# Altium project Switchberry.PrjPcb (part 2 of 3)

## Sheet 07-KSZ9031_1G_BASET_XCVR.SchDoc
size C; SheetNumber: 7; SheetTotal: 13
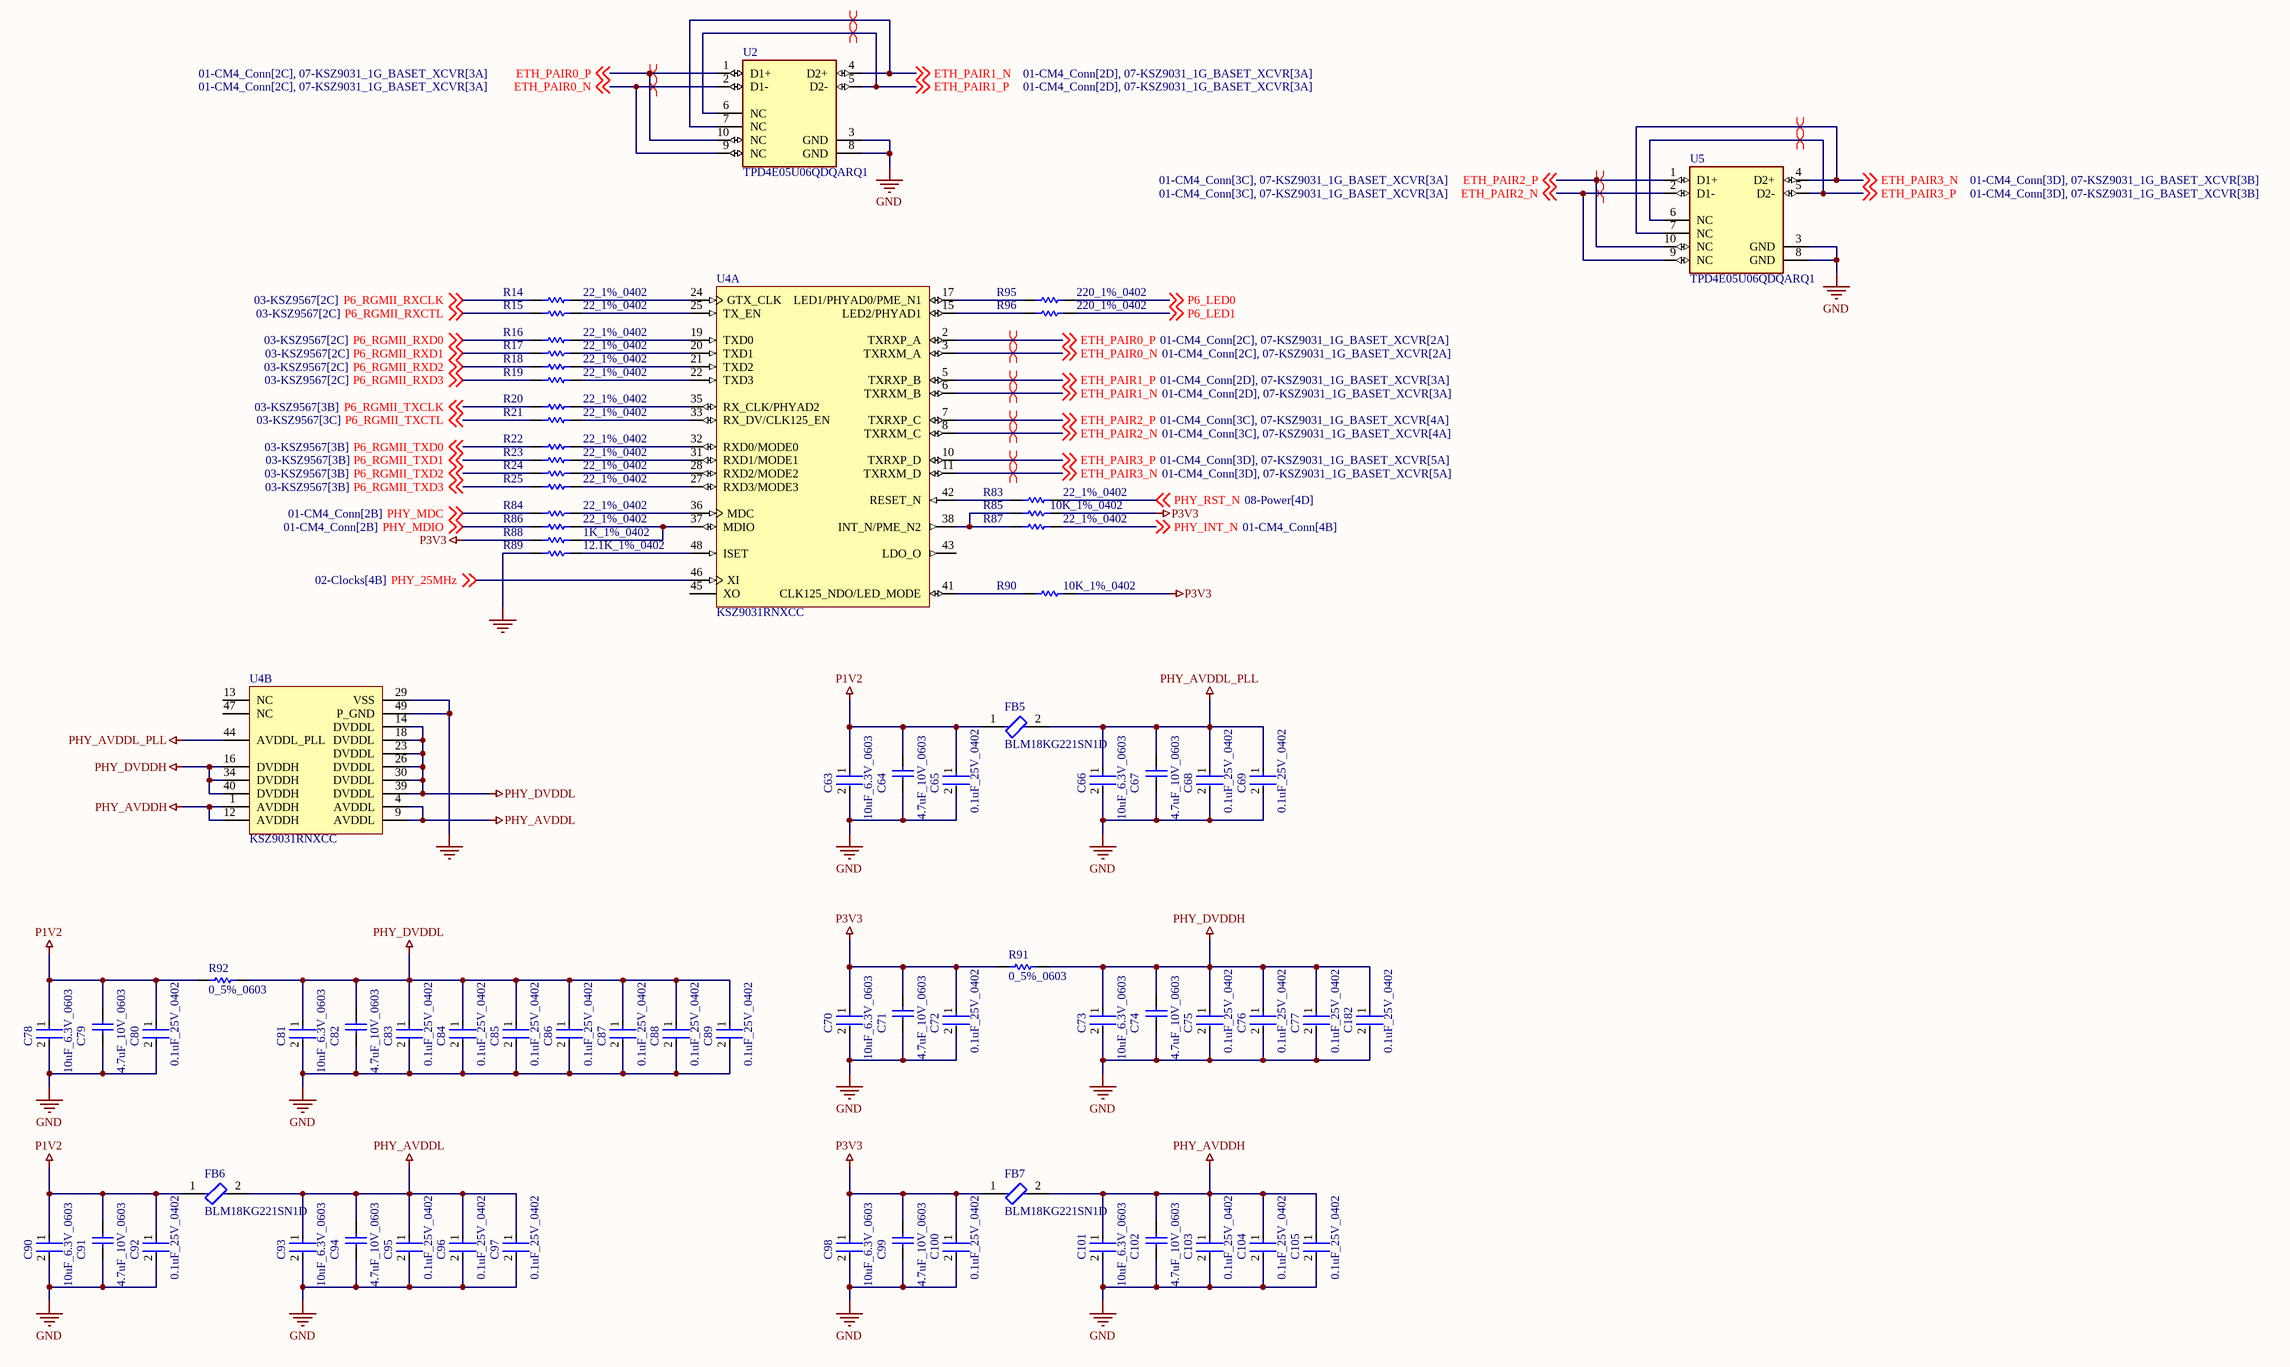
[diagram p5: 07-KSZ9031_1G_BASET_XCVR.SchDoc]

### Parts
C63  10uF_6.3V_0603  [FP-C0603C106M9PACTU-MFG]
C64  4.7uF_10V_0603  [CAPC1608X87X35NL15T15]
C65  0.1uF_25V_0402  [FP-0402-L_1_0_1-W_0_5_0_1-IPC_C]
C66  10uF_6.3V_0603  [FP-C0603C106M9PACTU-MFG]
C67  4.7uF_10V_0603  [CAPC1608X87X35NL15T15]
C68  0.1uF_25V_0402  [FP-0402-L_1_0_1-W_0_5_0_1-IPC_C]
C69  0.1uF_25V_0402  [FP-0402-L_1_0_1-W_0_5_0_1-IPC_C]
C70  10uF_6.3V_0603  [FP-C0603C106M9PACTU-MFG]
C71  4.7uF_10V_0603  [CAPC1608X87X35NL15T15]
C72  0.1uF_25V_0402  [FP-0402-L_1_0_1-W_0_5_0_1-IPC_C]
C73  10uF_6.3V_0603  [FP-C0603C106M9PACTU-MFG]
C74  4.7uF_10V_0603  [CAPC1608X87X35NL15T15]
C75  0.1uF_25V_0402  [FP-0402-L_1_0_1-W_0_5_0_1-IPC_C]
C76  0.1uF_25V_0402  [FP-0402-L_1_0_1-W_0_5_0_1-IPC_C]
C77  0.1uF_25V_0402  [FP-0402-L_1_0_1-W_0_5_0_1-IPC_C]
C78  10uF_6.3V_0603  [FP-C0603C106M9PACTU-MFG]
C79  4.7uF_10V_0603  [CAPC1608X87X35NL15T15]
C80  0.1uF_25V_0402  [FP-0402-L_1_0_1-W_0_5_0_1-IPC_C]
C81  10uF_6.3V_0603  [FP-C0603C106M9PACTU-MFG]
C82  4.7uF_10V_0603  [CAPC1608X87X35NL15T15]
C83  0.1uF_25V_0402  [FP-0402-L_1_0_1-W_0_5_0_1-IPC_C]
C84  0.1uF_25V_0402  [FP-0402-L_1_0_1-W_0_5_0_1-IPC_C]
C85  0.1uF_25V_0402  [FP-0402-L_1_0_1-W_0_5_0_1-IPC_C]
C86  0.1uF_25V_0402  [FP-0402-L_1_0_1-W_0_5_0_1-IPC_C]
C87  0.1uF_25V_0402  [FP-0402-L_1_0_1-W_0_5_0_1-IPC_C]
C88  0.1uF_25V_0402  [FP-0402-L_1_0_1-W_0_5_0_1-IPC_C]
C89  0.1uF_25V_0402  [FP-0402-L_1_0_1-W_0_5_0_1-IPC_C]
C90  10uF_6.3V_0603  [FP-C0603C106M9PACTU-MFG]
C91  4.7uF_10V_0603  [CAPC1608X87X35NL15T15]
C92  0.1uF_25V_0402  [FP-0402-L_1_0_1-W_0_5_0_1-IPC_C]
C93  10uF_6.3V_0603  [FP-C0603C106M9PACTU-MFG]
C94  4.7uF_10V_0603  [CAPC1608X87X35NL15T15]
C95  0.1uF_25V_0402  [FP-0402-L_1_0_1-W_0_5_0_1-IPC_C]
C96  0.1uF_25V_0402  [FP-0402-L_1_0_1-W_0_5_0_1-IPC_C]
C97  0.1uF_25V_0402  [FP-0402-L_1_0_1-W_0_5_0_1-IPC_C]
C98  10uF_6.3V_0603  [FP-C0603C106M9PACTU-MFG]
C99  4.7uF_10V_0603  [CAPC1608X87X35NL15T15]
C100  0.1uF_25V_0402  [FP-0402-L_1_0_1-W_0_5_0_1-IPC_C]
C101  10uF_6.3V_0603  [FP-C0603C106M9PACTU-MFG]
C102  4.7uF_10V_0603  [CAPC1608X87X35NL15T15]
C103  0.1uF_25V_0402  [FP-0402-L_1_0_1-W_0_5_0_1-IPC_C]
C104  0.1uF_25V_0402  [FP-0402-L_1_0_1-W_0_5_0_1-IPC_C]
C105  0.1uF_25V_0402  [FP-0402-L_1_0_1-W_0_5_0_1-IPC_C]
C182  0.1uF_25V_0402  [FP-0402-L_1_0_1-W_0_5_0_1-IPC_C]
FB5  BLM18KG221SN1D  [FP-BLM18-0_15-t0_8-IPC_B]
FB6  BLM18KG221SN1D  [FP-BLM18-0_15-t0_8-IPC_B]
FB7  BLM18KG221SN1D  [FP-BLM18-0_15-t0_8-IPC_B]
R14  22_1%_0402  [RESC1005X40X25ML05T10]
R15  22_1%_0402  [RESC1005X40X25ML05T10]
R16  22_1%_0402  [RESC1005X40X25ML05T10]
R17  22_1%_0402  [RESC1005X40X25ML05T10]
R18  22_1%_0402  [RESC1005X40X25ML05T10]
R19  22_1%_0402  [RESC1005X40X25ML05T10]
R20  22_1%_0402  [RESC1005X40X25ML05T10]
R21  22_1%_0402  [RESC1005X40X25ML05T10]
R22  22_1%_0402  [RESC1005X40X25ML05T10]
R23  22_1%_0402  [RESC1005X40X25ML05T10]
R24  22_1%_0402  [RESC1005X40X25ML05T10]
R25  22_1%_0402  [RESC1005X40X25ML05T10]
R83  22_1%_0402  [RESC1005X40X25ML05T10]
R84  22_1%_0402  [RESC1005X40X25ML05T10]
R85  10K_1%_0402  [RESC1005X40X25NL10T10]
R86  22_1%_0402  [RESC1005X40X25ML05T10]
R87  22_1%_0402  [RESC1005X40X25ML05T10]
R88  1K_1%_0402  [RESC1005X40X25ML05T10]
R89  12.1K_1%_0402  [RESC1005X40X25NL10T10]
R90  10K_1%_0402  [RESC1005X40X25NL10T10]
R91  0_5%_0603  [RESC1608X55X25ML10T15]
R92  0_5%_0603  [RESC1608X55X25ML10T15]
R95  220_1%_0402  [RESC1005X40X25NL05T10]
R96  220_1%_0402  [RESC1005X40X25NL05T10]
U2  TPD4E05U06QDQARQ1  [FP-DQA0010A-MFG]
U4  KSZ9031RNXCC  [MICL-QFN-48_V]  (parts A,B of 2)
U5  TPD4E05U06QDQARQ1  [FP-DQA0010A-MFG]

### Nets
GND: C63.2 C64.1 C65.2 C66.2 C67.1 C68.2 C69.2 C70.2 C71.1 C72.2 C73.2 C74.1 C75.2 C76.2 C77.2 C78.2 C79.1 C80.2 C81.2 C82.1 C83.2 C84.2 C85.2 C86.2 C87.2 C88.2 C89.2 C90.2 C91.1 C92.2 C93.2 C94.1 C95.2 C96.2 C97.2 C98.2 C99.1 C100.2 C101.2 C102.1 C103.2 C104.2 C105.2 C182.2 R89.1 U2.3(GND) U2.8(GND) U4.29(VSS) U4.49(P_GND) U5.3(GND) U5.8(GND)
P1V2: C63.1 C64.2 C65.1 C78.1 C79.2 C80.1 C90.1 C91.2 C92.1 FB5.1 FB6.1 R92.1
P3V3: C70.1 C71.2 C72.1 C98.1 C99.2 C100.1 FB7.1 R85.2 R88.1 R90.2 R91.1
PHY_AVDDH: C101.1 C102.2 C103.1 C104.1 C105.1 FB7.2 U4.1(AVDDH) U4.12(AVDDH)
PHY_AVDDL: C93.1 C94.2 C95.1 C96.1 C97.1 FB6.2 U4.4(AVDDL) U4.9(AVDDL)
PHY_AVDDL_PLL: C66.1 C67.2 C68.1 C69.1 FB5.2 U4.44(AVDDL_PLL)
PHY_DVDDH: C73.1 C74.2 C75.1 C76.1 C77.1 C182.1 R91.2 U4.16(DVDDH) U4.34(DVDDH) U4.40(DVDDH)
PHY_DVDDL: C81.1 C82.2 C83.1 C84.1 C85.1 C86.1 C87.1 C88.1 C89.1 R92.2 U4.14(DVDDL) U4.18(DVDDL) U4.23(DVDDL) U4.26(DVDDL) U4.30(DVDDL) U4.39(DVDDL)
ETH_PAIR0_N: U2.2(D1-) U2.9(NC) U4.3(TXRXM_A) ; off-sheet ETH_PAIR0_N
ETH_PAIR0_P: U2.1(D1+) U2.10(NC) U4.2(TXRXP_A) ; off-sheet ETH_PAIR0_P
ETH_PAIR1_N: U2.4(D2+) U2.7(NC) U4.6(TXRXM_B) ; off-sheet ETH_PAIR1_N
ETH_PAIR1_P: U2.5(D2-) U2.6(NC) U4.5(TXRXP_B) ; off-sheet ETH_PAIR1_P
ETH_PAIR2_N: U4.8(TXRXM_C) U5.2(D1-) U5.9(NC) ; off-sheet ETH_PAIR2_N
ETH_PAIR2_P: U4.7(TXRXP_C) U5.1(D1+) U5.10(NC) ; off-sheet ETH_PAIR2_P
ETH_PAIR3_N: U4.11(TXRXM_D) U5.4(D2+) U5.7(NC) ; off-sheet ETH_PAIR3_N
ETH_PAIR3_P: U4.10(TXRXP_D) U5.5(D2-) U5.6(NC) ; off-sheet ETH_PAIR3_P
P6_LED0: R95.2 ; off-sheet P6_LED0
P6_LED1: R96.2 ; off-sheet P6_LED1
P6_RGMII_RXCLK: R14.1 ; off-sheet P6_RGMII_RXCLK
P6_RGMII_RXCTL: R15.1 ; off-sheet P6_RGMII_RXCTL
P6_RGMII_RXD0: R16.1 ; off-sheet P6_RGMII_RXD0
P6_RGMII_RXD1: R17.1 ; off-sheet P6_RGMII_RXD1
P6_RGMII_RXD2: R18.1 ; off-sheet P6_RGMII_RXD2
P6_RGMII_RXD3: R19.1 ; off-sheet P6_RGMII_RXD3
P6_RGMII_TXCLK: R20.1 ; off-sheet P6_RGMII_TXCLK
P6_RGMII_TXCTL: R21.1 ; off-sheet P6_RGMII_TXCTL
P6_RGMII_TXD0: R22.1 ; off-sheet P6_RGMII_TXD0
P6_RGMII_TXD1: R23.1 ; off-sheet P6_RGMII_TXD1
P6_RGMII_TXD2: R24.1 ; off-sheet P6_RGMII_TXD2
P6_RGMII_TXD3: R25.1 ; off-sheet P6_RGMII_TXD3
PHY_25MHz: U4.46(XI) ; off-sheet PHY_25MHz
PHY_INT_N: R87.2 ; off-sheet PHY_INT_N
PHY_MDC: R84.1 ; off-sheet PHY_MDC
PHY_MDIO: R86.1 ; off-sheet PHY_MDIO
PHY_RST_N: R83.2 ; off-sheet PHY_RST_N
NetR14_2: R14.2 U4.24(GTX_CLK)
NetR15_2: R15.2 U4.25(TX_EN)
NetR16_2: R16.2 U4.19(TXD0)
NetR17_2: R17.2 U4.20(TXD1)
NetR18_2: R18.2 U4.21(TXD2)
NetR19_2: R19.2 U4.22(TXD3)
NetR20_2: R20.2 U4.35(RX_CLK/PHYAD2)
NetR21_2: R21.2 U4.33(RX_DV/CLK125_EN)
NetR22_2: R22.2 U4.32(RXD0/MODE0)
NetR23_2: R23.2 U4.31(RXD1/MODE1)
NetR24_2: R24.2 U4.28(RXD2/MODE2)
NetR25_2: R25.2 U4.27(RXD3/MODE3)
NetR83_1: R83.1 U4.42(RESET_N)
NetR84_2: R84.2 U4.36(MDC)
NetR85_1: R85.1 R87.1 U4.38(INT_N/PME_N2)
NetR86_2: R86.2 R88.2 U4.37(MDIO)
NetR89_2: R89.2 U4.48(ISET)
NetR90_1: R90.1 U4.41(CLK125_NDO/LED_MODE)
NetR95_1: R95.1 U4.17(LED1/PHYAD0/PME_N1)
NetR96_1: R96.1 U4.15(LED2/PHYAD1)

Not connected (* = marked no-connect by the designer): U4 13(NC) 43(LDO_O) 45(XO) 47(NC)

### Layout directives
differential pair: ETH_PAIR0_N, ETH_PAIR0_P, ETH_PAIR1_N, ETH_PAIR1_P, ETH_PAIR2_N, ETH_PAIR2_P, ETH_PAIR3_N, ETH_PAIR3_P

### Library data of the parts
C63 C66 C70 C73 C78 C81 C90 C93 C98 C101 = CMP-2006-02285-3: CAP CER 10UF 6.3V X5R 0603; Manufacturer Part Number: C0603C106M9PACTU; Manufacturer: Kemet; Material: Ceramic; Temperature Coefficient: 15%; Tolerance: 20%; Category: Cap; Height: 0.9mm; Digikey Description: CAP CER 10UF 6.3V X5R 0603; Mouser Description: In a Pack of 10, KEMET 0603 (1608M) 10µF MLCC 6.3V dc ±20% SMD C0603C106M9PACTU; Voltage Rating: 6.3V; Device Class L2: Capacitors; Temperature Range Low: -55°C; Temperature Characteristic: X5R; ComponentLink2Description: Datasheet; Ipc Land Pattern Name: CAPC16080X80; ComponentLink2URL: http://www.kemet.com/Lists/ProductCatalog/Attachments/19/KEM_C1006_X5R_SMD.pdf; Capacitance: 10uF; Temperature Range High: +85°C; Device Class L3: Ceramic Capacitors; RoHS: TRUE; Automotive: No; Value: 10uF; Temperature: -55°C to +85°C; Device Class L1: Passive Components; Package: C0603C106M9PACTU; Lead Free: Yes; Octopart: https://octopart.com/c0603c106m9pactu-kemet-8375727
C64 C67 C71 C74 C79 C82 C91 C94 C99 C102 = CMP-2006-03238-1: Part Number: C0603C475K8PACTU; Manufacturer: Kemet
C65 C68 C69 C72 C75-C77 C80 C83-C89 C92 C95-C97 C100 C103-C105 C182 = CMP-2008-02519-2: as C3 on sheet 05-Switch_SFP_CM4_RJ45; Package Quantity: 1; Capacitance: 100nF; Min Operating Temperature: -55°C; Voltage: 25V; Voltage Rating: 25V; Construction: Flat; Max Operating Temperature: 125°C; Radiation Hardening: No; Depth: 0.5mm; Thickness: 0.022inch; Voltage Rating (DC): 25V; Number of Pins: 2; Lead Free: Lead Free; Series: -; REACH SVHC: No SVHC; Length: 1mm; Dielectric: X7R; RoHS Compliant: Yes; Mount: Surface Mount; Packaging: Tape and Reel; Case/Package: 0402; Case Code (Imperial): 0402; Termination: SMD/SMT; Width: 0.02inch; Case Code (Metric): 1005; Tolerance: 10%
FB5-FB7 = CMP-0686-00556-7: Chip Ferrite Bead, 0603, 220Ω @ 100MHz, 0.05Ω, 25%, 2.2A; DC Resistance (DCR): 50mR; Number of Circuits: 1; Impedance: 220R; Current Rating: 2.2A; Material: Ferrite; Test Frequency: 100MHz; Depth: 0.8mm; Series: BLM18K; RoHS Compliant: Yes; Termination: SMD/SMT; Max Current Rating: 2.2A; Case Code (Metric): 1608; Radiation Hardening: No; Number of Pins: 2; Length: 1.6mm; Lead Free: Lead Free; Package Quantity: 1; Height: 0.8mm; Core Material: Ferrite; Inductor Type: FERRITE BEAD; Min Operating Temperature: -55°C; Case/Package: 0603; Case Code (Imperial): 0603; Number of Lines: 1; Packaging: Tape and Reel; REACH SVHC: No SVHC; Max Operating Temperature: 125°C; Military Standard: Not; DC Resistance-Max: 50mR; Width: 0.8mm; DC Current: 2.2A; Max DC Current: 2.2A; Tolerance: 25%; Weight: 7.1E-05oz
R14-R25 R83 R84 R86 R87 = CMP-2002-07182-1: Part Number: RC0402FR-1322RL; Manufacturer: Yageo / Phycomp
R85 R90 = CMP-2002-04694-1: as R52 on sheet 01-CM4_Conn
R88 = CMP-2002-06478-1: Manufacturer: Multicomp; Part Number: MCMR04X1001FTL
R89 = CMP-2002-05926-1: Manufacturer: Multicomp; Part Number: MC00625W0402112K1
R91 R92 = CMP-2100-03667-1: Chip Resistor, 0 Ohm, +/- 5%, 0.1 W, -55 to 155 degC, 0603 (1608 Metric), RoHS, Tape and Reel; Manufacturer: Yageo; Temperature Coefficient: 200ppm/degreesC; Voltage Rating: 50V; Power Rating: 100mW; Resistance: 0mOhm; Width: 0.8mm; Max Operating Temperature: 155degC; Tolerance: 5%; Package Reference: 0603; Height: 0.45mm; Depth: 0.8mm; Package Description: 2-Pin Surface Mount Device, Body 1.6 x 0.8 mm; Termination: SMD/SMT; Package Quantity: 5000; Case/Package: 0603; Case Code (Imperial): 0603; Radiation Hardening: No; Number of Pins: 2; Length: 1.6mm; Lead Free: LeadFree; Voltage Rating (DC): 50V; Military Standard: Not; Datasheet URL: http://www.yageo.com/NewPortal/yageodocoutput?fileName=/pdf/R-Chip/PYu-RC_Group_51_RoHS_L_5.pdf; Manufacturer URL: http://www.yageo.com/; Packaging: TapeandReel; Case Code (Metric): 1608; Min Operating Temperature: -55degC; Composition: ThickFilm; RoHSCompliant: true; Contact Plating: Tin; Datasheet Version: Rev. 5, 10/2016; REACH SVHC: NoSVHC
R95 R96 = CMP-2002-07959-1: Manufacturer: Yageo / Phycomp; Part Number: RC0402JR-07220RL
U2 U5 = CMP-04985-000004-1: TVS DIODE 5.5V 14V 10USON; Manufacturer: Texas Instruments; Direction: Unidirectional; Standoff Height: 0mm; Capacitance: 0.5pF; Number Of Channels: 4; Breakdown Voltage: 6.4V; Peak Pulse Power: 2.5W; Automotive Grade: Grade 1; Value: 0.5pF; Interface: USB,Ethernet,LVDS,Other; Peak Pulse Current: 2.5A; Operating Supply Voltage: 5.5V; Reverse Standoff Voltage: 5.5V; Package: DQA0010A; Temperature Range Low: -40°C; Temperature Range High: +125°C; Ambient Temperature Range Low: -40°C; Device Class L1: Circuit Protection; Clamping Voltage: 14V; Manufacturer Part Number: TPD4E05U06QDQARQ1; Device Class L2: ESD and Circuit Protection ICs; Octopart: https://octopart.com/tpd4e05u06qdqarq1-texas+instruments-48523459; Device Class L3: unset; Height: 0.55mm; Automotive: Yes; ComponentLink2Description: Datasheet; RoHS: TRUE; Ambient Temperature Range High: +125°C; Category: IC; Mouser Description: Automotive 4-Channel ESD Protection Solution for SuperSpeed (up to 5 Gbps) Interface 10-USON -40 to 125; Temperature: -40°C to +125°C; ComponentLink2URL: http://www.ti.com/lit/ds/symlink/tpd4e05u06-q1.pdf; Digikey Description: TVS DIODE 5.5V 14V 10USON; Lead Free: Yes
U4 = CMP-1337-00003-2: Gigabit Ethernet Transceiver with RGMII Support, 1.14 to 1.26 V, 0 to 70 degC, 48-Pin QFN, RoHS; Manufacturer: Micrel; Output Tri-State Leakage: 10 uA Max.; ILED: 8 mA Typ.; Receivers: 4; VSET@R(ISET): 12.1 KOhm=1.2 V Typ.; DatasheetVersion: Rev. 2.1; PackageDescription: 48-Pin Quad Flat Non-Lead Package, Body 7 x 7 mm, Pitch 0.5 mm; RoHS: TRUE; DVDDL: 1.14 to 1.26 V; ComponentLink1URL: http://www.micrel.com/; PartNumber: KSZ9031RNXCC; Temperature Range: 0 to 70 degC; ComponentLink1Description: Manufacturer URL; ComponentLink3Description: Package Specification; Mounting Technology: Surface Mount; ComponentLink2Description: Datasheet; Drivers: 4; ComponentLink2URL: http://www.micrel.com/_PDF/Ethernet/datasheets/KSZ9031RNX.pdf; ComponentLink3URL: http://www.micrel.com/_PDF/Ethernet/datasheets/KSZ9031RNX.pdf

## Sheet 08-Power.SchDoc
size B; SheetNumber: 8; SheetTotal: 11
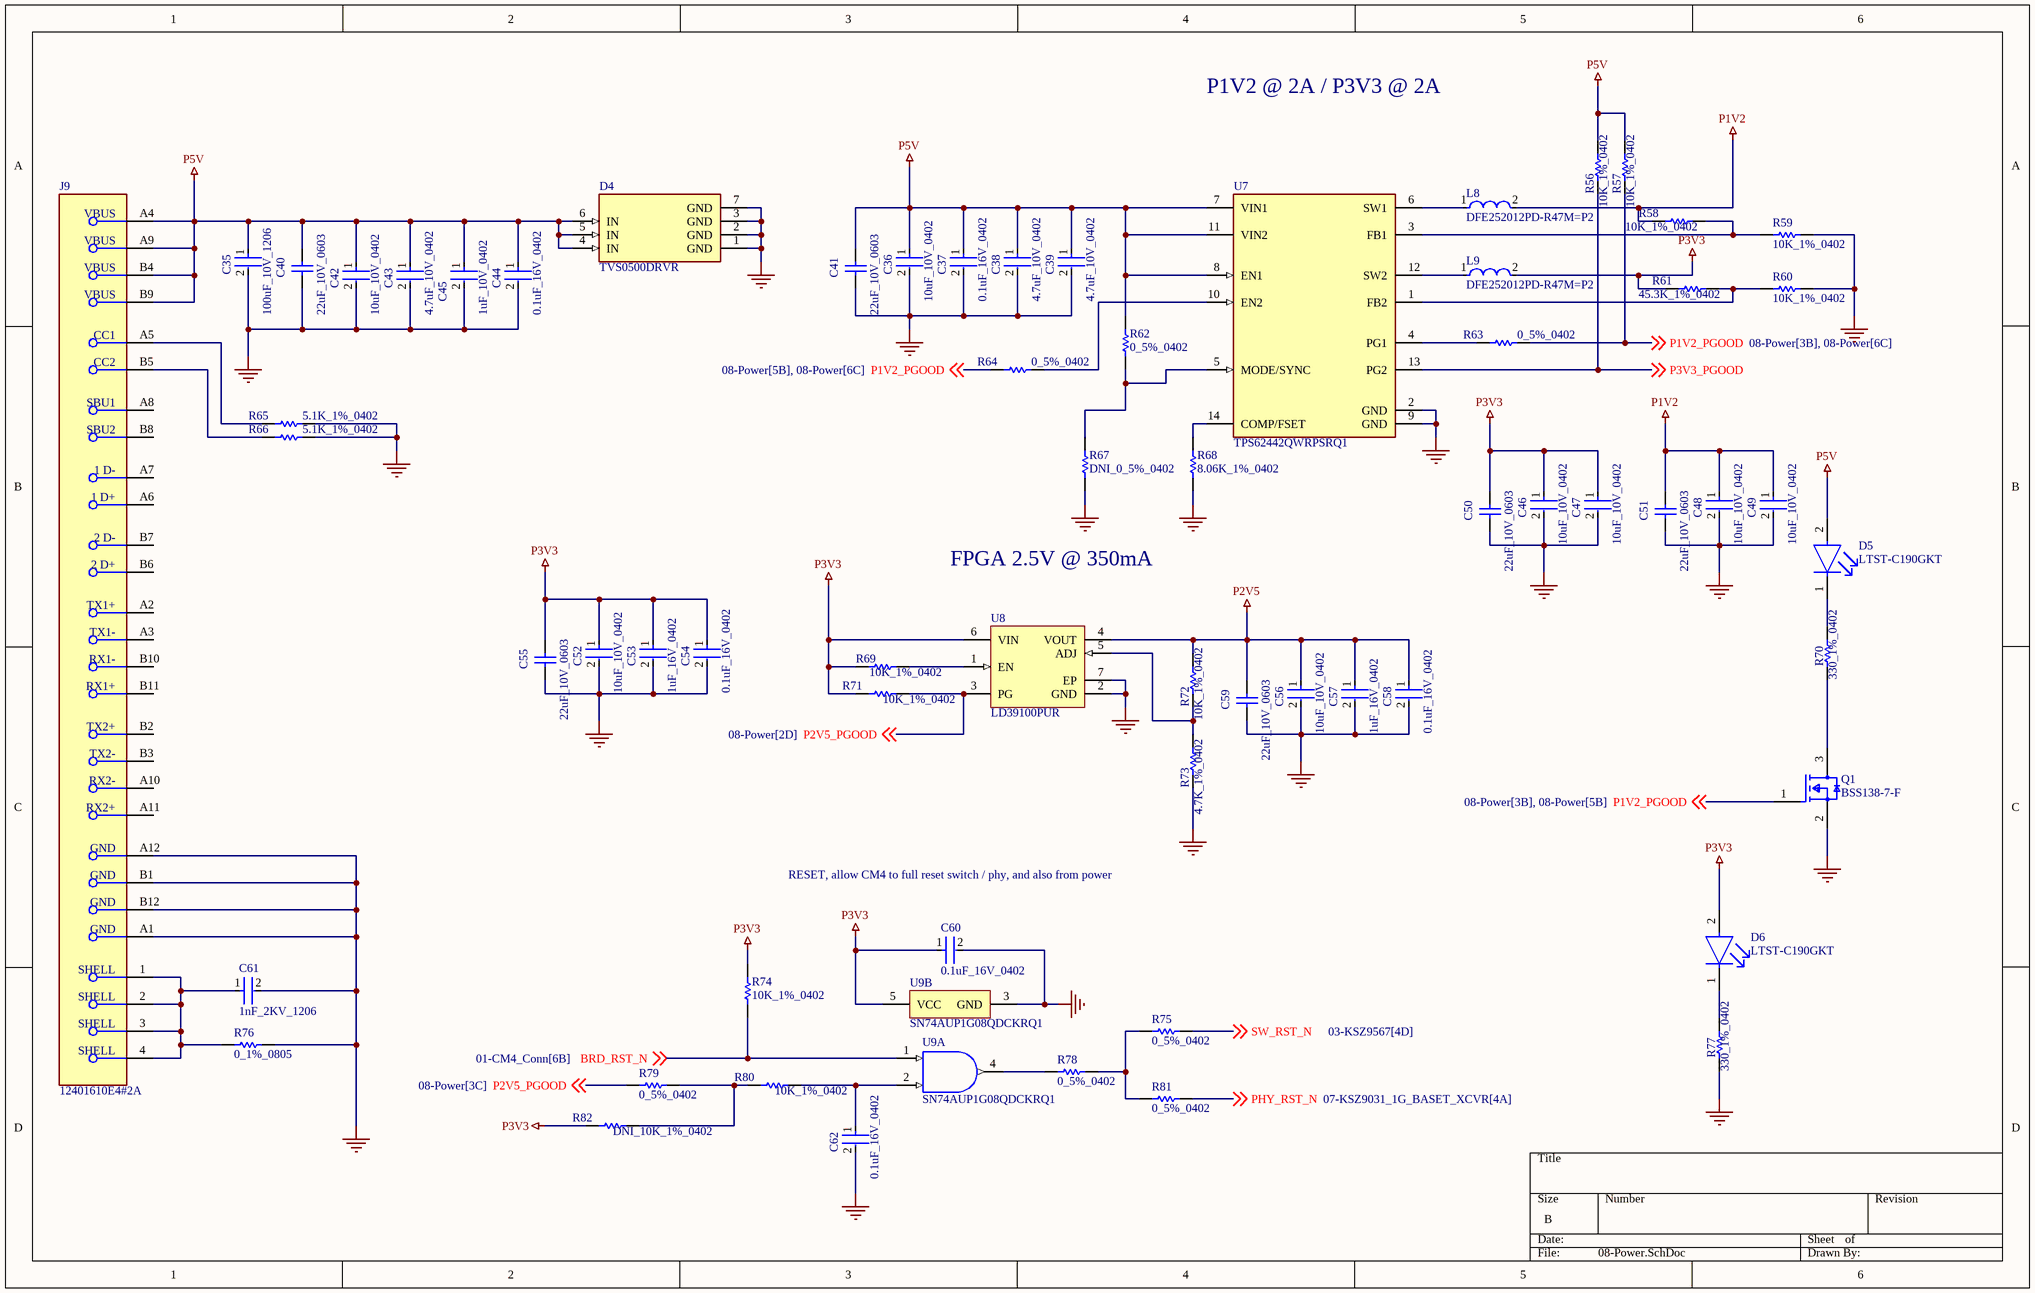
[diagram p6: 08-Power.SchDoc]

### Parts
C35  100uF_10V_1206  [FP-C3216-160-0_3-IPC_C]
C36  10uF_10V_0402  [FP-CL05A106MP5NUNC-MFG]
C37  0.1uF_16V_0402  [FP-C0402-BB-MFG]
C38  4.7uF_10V_0402  [FP-C1005-050-0_15-MFG]
C39  4.7uF_10V_0402  [FP-C1005-050-0_15-MFG]
C40  22uF_10V_0603  [CAPC1608X100X20ML10]
C41  22uF_10V_0603  [CAPC1608X100X20ML10]
C42  10uF_10V_0402  [FP-CL05A106MP5NUNC-MFG]
C43  4.7uF_10V_0402  [FP-C1005-050-0_15-MFG]
C44  0.1uF_16V_0402  [FP-C0402-BB-MFG]
C45  1uF_10V_0402  [FP-CL511-IPC_C]
C46  10uF_10V_0402  [FP-CL05A106MP5NUNC-MFG]
C47  10uF_10V_0402  [FP-CL05A106MP5NUNC-MFG]
C48  10uF_10V_0402  [FP-CL05A106MP5NUNC-MFG]
C49  10uF_10V_0402  [FP-CL05A106MP5NUNC-MFG]
C50  22uF_10V_0603  [CAPC1608X100X20ML10]
C51  22uF_10V_0603  [CAPC1608X100X20ML10]
C52  10uF_10V_0402  [FP-CL05A106MP5NUNC-MFG]
C53  1uF_16V_0402  [FP-0402-L_1_0_0_05-W_0_5-IPC_A]
C54  0.1uF_16V_0402  [FP-C0402-BB-MFG]
C55  22uF_10V_0603  [CAPC1608X100X20ML10]
C56  10uF_10V_0402  [FP-CL05A106MP5NUNC-MFG]
C57  1uF_16V_0402  [FP-0402-L_1_0_0_05-W_0_5-IPC_A]
C58  0.1uF_16V_0402  [FP-C0402-BB-MFG]
C59  22uF_10V_0603  [CAPC1608X100X20ML10]
C60  0.1uF_16V_0402  [FP-C0402-BB-MFG]
C61  1nF_2KV_1206  [FP-CC1206-0_3-1_45-IPC_C]
C62  0.1uF_16V_0402  [FP-C0402-BB-MFG]
D4  TVS0500DRVR  [FP-DRV0006A-MFG]
D5  LTST-C190GKT  [FP-LTST-C190GKT-MFG]
D6  LTST-C190GKT  [FP-LTST-C190GKT-MFG]
J9  12401610E4#2A  [FP-12401610E4#2A-MFG]
L8  DFE252012PD-R47M=P2  [FP-DFE252012C-IPC_A]
L9  DFE252012PD-R47M=P2  [FP-DFE252012C-IPC_A]
Q1  BSS138-7-F  [FP-SOT23_Standard-MFG]
R56  10K_1%_0402  [RESC1005X40X25NL10T10]
R57  10K_1%_0402  [RESC1005X40X25NL10T10]
R58  10K_1%_0402  [RESC1005X40X25NL10T10]
R59  10K_1%_0402  [RESC1005X40X25NL10T10]
R60  10K_1%_0402  [RESC1005X40X25NL10T10]
R61  45.3K_1%_0402  [RESC0402(1005)_L]
R62  0_5%_0402  [RESC1005X40X25NL05T10]
R63  0_5%_0402  [RESC1005X40X25NL05T10]
R64  0_5%_0402  [RESC1005X40X25NL05T10]
R65  5.1K_1%_0402  [RESC1005X40X25NL05T10]
R66  5.1K_1%_0402  [RESC1005X40X25NL05T10]
R67  DNI_0_5%_0402  [RESC1005X40X25NL05T10]  (no BOM)
R68  8.06K_1%_0402  [RESC1005X40X25ML05T05]
R69  10K_1%_0402  [RESC1005X40X25NL10T10]
R70  330_1%_0402  [RESC1005X40X25NL10T10]
R71  10K_1%_0402  [RESC1005X40X25NL10T10]
R72  10K_1%_0402  [RESC1005X40X25NL10T10]
R73  4.7K_1%_0402  [RESC1005X40X25NL10T10]
R74  10K_1%_0402  [RESC1005X40X25NL10T10]
R75  0_5%_0402  [RESC1005X40X25NL05T10]
R76  0_1%_0805  [RESC2013X60X35NL10T20]
R77  330_1%_0402  [RESC1005X40X25NL10T10]
R78  0_5%_0402  [RESC1005X40X25NL05T10]
R79  0_5%_0402  [RESC1005X40X25NL05T10]
R80  10K_1%_0402  [RESC1005X40X25NL10T10]
R81  0_5%_0402  [RESC1005X40X25NL05T10]
R82  DNI_10K_1%_0402  [RESC1005X40X25NL10T10]  (no BOM)
U7  TPS62442QWRPSRQ1  [FP-RQR0014A-MFG]
U8  LD39100PUR  [DFN6D_M]
U9  SN74AUP1G08QDCKRQ1  [DCK0005A_L]  (parts A,B of 2)

### Nets
GND: C35.2 C36.2 C37.2 C38.2 C39.2 C40.1 C41.1 C42.2 C43.2 C44.2 C45.2 C46.2 C47.2 C48.2 C49.2 C50.1 C51.1 C52.2 C53.2 C54.2 C55.1 C56.2 C57.2 C58.2 C59.1 C60.2 C61.2 C62.2 D4.1(GND) D4.2(GND) D4.3(GND) D4.7(GND) J9.A1(GND) J9.A12(GND) J9.B1(GND) J9.B12(GND) Q1.2(S) R59.1 R60.1 R65.2 R66.2 R67.1 R68.1 R73.1 R76.2 R77.1 U7.2(GND) U7.9(GND) U8.2(GND) U8.7(EP) U9.3(GND)
P1V2: C48.1 C49.1 C51.2 L8.2 R58.2
P2V5: C56.1 C57.1 C58.1 C59.2 R72.2 U8.4(VOUT)
P3V3: C46.1 C47.1 C50.2 C52.1 C53.1 C54.1 C55.2 C60.1 D6.2(A) L9.2 R61.1 R69.2 R71.2 R74.1 R82.2 U8.6(VIN) U9.5(VCC)
P5V: C35.1 C36.1 C37.1 C38.1 C39.1 C40.2 C41.2 C42.1 C43.1 C44.1 C45.1 D4.4(IN) D4.5(IN) D4.6(IN) D5.2(A) J9.A4(VBUS) J9.A9(VBUS) J9.B4(VBUS) J9.B9(VBUS) R56.2 R57.2 R62.2 U7.7(VIN1) U7.8(EN1) U7.11(VIN2)
BRD_RST_N: R74.2 U9.1(A) ; off-sheet BRD_RST_N
P1V2_PGOOD: Q1.1(G) R57.1 R63.2 R64.1 ; off-sheet P1V2_PGOOD
P2V5_PGOOD: R71.1 R79.2 U8.3(PG) ; off-sheet P2V5_PGOOD
P3V3_PGOOD: R56.1 U7.13(PG2) ; off-sheet P3V3_PGOOD
PHY_RST_N: R81.1 ; off-sheet PHY_RST_N
SW_RST_N: R75.1 ; off-sheet SW_RST_N
NetC61_1: C61.1 J9.1(SHELL) J9.2(SHELL) J9.3(SHELL) J9.4(SHELL) R76.1
NetC62_1: C62.1 R80.1 U9.2(B)
NetD5_1: D5.1(C) R70.2
NetD6_1: D6.1(C) R77.2
NetJ9_A5: J9.A5(CC1) R65.1
NetJ9_B5: J9.B5(CC2) R66.1
NetL8_1: L8.1 U7.6(SW1)
NetL9_1: L9.1 U7.12(SW2)
NetQ1_3: Q1.3(D) R70.1
NetR58_1: R58.1 R59.2 U7.3(FB1)
NetR60_2: R60.2 R61.2 U7.1(FB2)
NetR62_1: R62.1 R67.2 U7.5(MODE/SYNC)
NetR63_1: R63.1 U7.4(PG1)
NetR64_2: R64.2 U7.10(EN2)
NetR68_2: R68.2 U7.14(COMP/FSET)
NetR69_1: R69.1 U8.1(EN)
NetR72_1: R72.1 R73.2 U8.5(ADJ)
NetR75_2: R75.2 R78.1 R81.2
NetR78_2: R78.2 U9.4(Y)
NetR79_1: R79.1 R80.2 R82.1

Not connected (* = marked no-connect by the designer): J9 A2(TX1+) A3(TX1-) A6(1_D+) A7(1_D-) A8(SBU1) A10(RX2-) A11(RX2+) B2(TX2+) B3(TX2-) B6(2_D+) B7(2_D-) B8(SBU2) B10(RX1-) B11(RX1+)

### Notes on the sheet
- P1V2 @ 2A / P3V3 @ 2A
- FPGA 2.5V @ 350mA
- RESET, allow CM4 to full reset switch / phy, and also from power

### Library data of the parts
C35 = CMP-2000-05396-3: Multilayer Ceramic Capacitors 100uF ±20% 10V X5R SMD 1206; Voltage Rating (DC): 10V; Length: 3.2mm; Mount: Surface Mount; Depth: 1.6mm; Width: 1.6mm; Package Quantity: 1; Min Operating Temperature: -55°C; Packaging: Tape and Reel; Max Operating Temperature: 85°C; Dielectric: X5R; Construction: Flat; Case Code (Imperial): 1206; Capacitance: 100uF; Thickness: 0.075inch; Radiation Hardening: No; RoHS Compliant: Yes; Series: C; Dielectric Material: Ceramic; Voltage: 10V; REACH SVHC: No SVHC; Case Code (Metric): 3216; Weight: 0.000571oz; Height: 1.6mm; Voltage Rating: 10V; Termination: SMD/SMT; Lead Free: Lead Free; Tolerance: 20%; Case/Package: 1206; Resistor Type: Ceramic
C36 C42 C46-C49 C52 C56 = CMP-13271-000002-1: CAP CER 10UF 10V X5R 0402; Manufacturer Part Number: CL05A106MP5NUNC; Manufacturer: Samsung; Temperature Coefficient: 15%; Tolerance: 20%; Material: Ceramic; Octopart: https://octopart.com/cl05a106mp5nunc-samsung-22457395; Voltage Rating: 10V; RoHS: TRUE; Value: 10uF; Height: 0.7mm; Digikey Description: CAP CER 10UF 10V X5R 0402; Automotive: No; Package: CL05A106MP5NUNC; Device Class L1: Passive Components; Capacitance: 10uF; Temperature Range High: +85°C; ComponentLink2Description: Datasheet; Device Class L2: Capacitors; Temperature Characteristic: X5R; Temperature: -55°C to +85°C; ComponentLink2URL: http://www.samsungsem.com/kr/support/product-search/mlcc/__icsFiles/afieldfile/2019/05/10/19-CL05A106MP5NUNC.pdf; Device Class L3: Ceramic Capacitors; Category: Cap; Temperature Range Low: -55°C; Ipc Land Pattern Name: CAPC10050X50; Lead Free: Yes
C37 C44 C54 C58 C60 C62 = CMP-1034-02068-3: CAP CER 0.1UF 16V 5% X7R 0402; Manufacturer: Kemet; Manufacturer Part Number: C0402C104J4RACTU; Value: 0.10 μF; Temperature Coefficient: 15%; Tolerance: 0.05; Material: Ceramic; ComponentLink2URL: https://content.kemet.com/datasheets/KEM_C1002_X7R_SMD.pdf; Automotive: No; Device Class L2: Capacitors; Temperature: -55°C to +125°C; RoHS: TRUE; Voltage Rating: 16 V; ComponentLink2Description: Datasheet; Device Class L3: Ceramic Capacitors; Temperature Range Low: -55°C; Ipc Land Pattern Name: CAPC10050X50; Device Class L1: Passive Components; Temperature Range High: +125°C; Package: C0402-BB; Capacitance: 0.10 μF; Category: Cap; Mouser Description: CAP CER 0.1UF 16V X7R 0402; Height: 0.55mm; Digikey Description: CAP CER 0.1UF 16V 5% X7R 0402; Octopart: https://octopart.com/c0402c104j4ractu-kemet-12573893; Temperature Characteristic: X7R; Lead Free: Yes
C38 C39 C43 = CMP-2000-05997-2: CAP CER 4.7UF 10V X5R 0402; Dielectric Material: Ceramic; Tolerance: 10%; Series: C; Package Quantity: 10000; Max Operating Temperature: 85°C; Case Code (Imperial): 0402; Lead Free: Lead Free; Voltage Rating (DC): 10V; Packaging: Cut Tape; Voltage Rating: 10V; Min Operating Temperature: -55°C; Dielectric: X5R; Thickness: 0.022inch; Width: 0.02inch; Case/Package: 0402; Case Code (Metric): 1005; Capacitance: 4.7uF; Length: 0.039inch; RoHS Compliant: Yes; REACH SVHC: No SVHC; Mount: Surface Mount
C40 C41 C50 C51 C55 C59 = CMP-2000-05441-1: Chip Capacitor, 22 uF, +/- 20%, 10 V, -55 to 85 degC, 0603 (1608 Metric), RoHS, Tape and Reel; Manufacturer: TDK; PCN Part Number: MLCCPartNumberChange30/Nov/2012; Voltage - Rated: 10V; Product Training Modules: CSeriesGeneralApplicationsSEAT,CCV,andTVCLDesignToolsGuidetoReplacinganElectrolyticCapacitorwithanMLCC; Other Names: 445-9077-1; Design Resources: 20WNon-IsolatedBuckLEDDriverUsingPLLNK460KG; Online Catalog: CSeries,GeneralPurpose; Capacitance: 22µF; Temperature Coefficient: X5R; Kits: 445-9014-KIT-ND-KITMLCC100PF-22UF060310-50V; Packaging: CutTape(CT); Standard Package: 1; Package / Case: 0603(1608Metric); Lead Style: -; Features: -; Ratings: -; Operating Temperature: -55degC~85degC; Applications: GeneralPurpose; Package Reference: 603; Datasheet URL: http://download.siliconexpert.com/pdfs/2015/4/21/15/54/45/779/tdk_/manual/37024850441143360mlcc_commercial_general_en.pdf; Datasheet Version: Mar-15; Mounting Type: SurfaceMount,MLCC; Lead Spacing: -; Size / Dimension: 0.063"Lx0.031"W(1.60mmx0.80mm); Height - Seated (Max): -; Package Description: 2-Pin Surface Mount Device, Body 1.6 x 0.8 mm; Manufacturer URL: http://www.tdk.com/; RoHS Information: RoHSCertificate-MLCC; Tolerance: ±20%; Series: C; Thickness (Max): 0.035"(0.90mm); Family: CeramicCapacitors; Category: Capacitors
C45 = CMP-13271-001936-1: Cap Ceramic 1uF 10V X5R ±10% SMD 0402 +85°C Paper T/R; Depth: 0.5mm; Case Code (Imperial): 0402; Material: Ceramic; Mount: Surface Mount; Thickness: 0.022inch; Dielectric: X5R; Capacitance: 1uF; Radiation Hardening: No; Case/Package: 0402; Length: 1mm; Tolerance: 10%; Max Operating Temperature: 85°C; Package Quantity: 1; Width: 0.02inch; Voltage Rating: 10V; Contact Plating: Tin; Height: 0.5mm; Min Operating Temperature: -55°C; Case Code (Metric): 1005; Packaging: Tape and Reel
C53 C57 = CMP-14477-000104-2: None; Tolerance: 10%; Voltage Rating: 16V; Dielectric: X5R; Capacitance: 1uF; Packaging: Tape and Reel; Depth: 0.5mm; Mount: Surface Mount; Thickness: 0.022inch; Package Quantity: 1; Min Operating Temperature: -55°C; Series: M; Voltage Rating (DC): 16V; Termination: SMD/SMT; Case/Package: 0402; Number of Pins: 2; Case Code (Imperial): 0402; Length: 1mm; Halogen Free: Halogen Free; Case Code (Metric): 1005; Width: 0.02inch; RoHS Compliant: Yes; Radiation Hardening: No; Max Operating Temperature: 85°C; Height: 0.5mm; Construction: Flat
C61 = CMP-2000-05436-2: CAP CER 1000PF 2KV X7R 1206; Capacitance: 1nF; Insulation Resistance: 10GR; Dissipation Factor: 2.5%; Tolerance: 10%; Termination: SMD/SMT; Voltage Rating (DC): 2kV; Case/Package: 1206; Length: 3.2mm; Depth: 1.6mm; Case Code (Imperial): 1206; Package Quantity: 1; Packaging: Tape and Reel; Dielectric: X7R; Mount: Surface Mount; Max Operating Temperature: 125°C; Lead Free: Lead Free; Number of Pins: 2; Thickness: 0.057inch; Width: 0.063inch; Resistor Type: Ceramic; Series: CC; RoHS Compliant: Yes; Voltage Rating: 2kV; Radiation Hardening: No; Construction: Flat; Height: 1.25mm; Min Operating Temperature: -55°C; Voltage: 2kV; Case Code (Metric): 3216
D4 = CMP-04989-000008-1: UNIDIR PRECISION SURGE DIODE; Peak Pulse Power: 400W; Power Line Protection: No; Reverse Standoff Voltage: 5V; Min Breakdown Voltage: 7.5V; Peak Pulse Current: 43A; Number of Unidirectional Channels: 1; Clamping Voltage: 9.5V; Packaging: Tape and Reel; Max Operating Temperature: 125°C; RoHS Compliant: Yes; Min Operating Temperature: -40°C; Mount: Surface Mount; Resistor Type: Zener; Number of Channels: 1
D5 D6 = CMP-22017-000005-2: LED GREEN CLEAR CHIP SMD; Dominant Wavelength: 569nm; Reverse Voltage: 5V; Lens Color: Colorless; Viewing Angle: 130°; Voltage: 2V; Forward Current: 30mA; Power Dissipation: 100mW; Luminous Intensity: 6mcd; Number of LEDs: 1; Forward Voltage: 2.1V; Wavelength: 565nm; Test Current: 10mA; Min Operating Temperature: -55°C; Lens Style: Clear; Mount: Surface Mount; Width: 0.8mm; Packaging: Tape and Reel; Lens Transparency: Clear; Case Code (Metric): 1608; Depth: 0.8mm; Case Code (Imperial): 0603; Case/Package: 0603; Number of Pins: 2; Max Operating Temperature: 85°C; Lead Free: Lead Free; Number of Elements: 1; Length: 1.6mm; Height: 0.8mm; Package Quantity: 1; Power Rating: 100mW; Radiation Hardening: No; Illumination Color: Green; Color: Green
J9 = CMP-02355-000003-1: CONN RCP USB3.1 TYPEC 24P SMD RA; Connector Type: USB; Number of Contacts: 24; Gender: Receptacle; Packaging: Cut Tape; Mount: Surface Mount; Number of Pins: 24
L8 L9 = CMP-06042-015149-1: Shielded Wirewound Inductor 0.47uH 20% 4000mA 0.027Ω 1008 (2520)
Q1 = CMP-2000-04930-2: NexarPartId: 335900; Voltage: 50V; Fall Time: 25ns; Number of Elements: 1; Turn-On Delay Time: 20ns; Drain to Source Resistance: 1.4Ω; Element Configuration: Single; Max Power Dissipation: 300mW; Current Rating: 200mA; Max Junction Temperature (Tj): 150°C; Input Capacitance: 50pF; Threshold Voltage: 1.2V; Current: 2A; Rds On Max: 3.5Ω; Rise Time: 10ns; Gate to Source Voltage (Vgs): 20V; Number of Pins: 3; Width: 1.3mm; Case/Package: SOT-23; Lead Free: Lead Free; Height: 1.15mm; Packaging: Cut Tape; Length: 2.9mm; REACH SVHC: No SVHC; Weight: 7.994566mg; Voltage Rating (DC): 50V; Contact Plating: Tin; Power Dissipation: 300mW; Mount: Surface Mount; Min Operating Temperature: -55°C; RoHS: Compliant; Max Operating Temperature: 150°C; Schedule B: 8541210080, 8541210080; Drain to Source Breakdown Voltage: 50V; Continuous Drain Current (ID): 200mA; Resistance: 3.5Ω; Number of Channels: 1; Drain to Source Voltage (Vdss): 50V; Turn-Off Delay Time: 20ns; Nominal Vgs: 1.2V
R56-R60 R69 R71 R72 R74 R80 R82 = CMP-2002-04694-1: as R52 on sheet 01-CM4_Conn
R61 = CMP-1011-00697-1: 45K3 0.063W 1% 0402 (1005 Metric)  SMD; Case-EIA: 0402; Case-Metric: 1005; Value: 45300.00 Ohm; Technology: SMT; Tolerance: 1 %; Power: 0.063 W
R62-R64 R67 R75 R78 R79 R81 = CMP-2002-06457-1: Manufacturer: Panasonic; Part Number: ERJ-U020R00X
R65 R66 = CMP-2002-07753-1: Part Number: RC0402FR-075K1L; Manufacturer: Yageo / Phycomp
R68 = CMP-2002-00253-3: Chip Resistor, 8.06 KOhm, +/- 1%, 63 mW, -55 to 155 degC, 0402 (1005 Metric), RoHS, Tape and Reel; PartNumber: CRCW04028K06FKED; Manufacturer: Basic Passives; Case\/Package: 0402; Power Rating: 63 mW; Voltage Rating: 50 V; PackageReference: 0402; Radiation Hardening: No; Package Quantity: 10000; Height: 0.35 mm; Packaging: Tape and Reel; Mount: Surface Mount; Length: 1 mm; Weight: 2.3E-05oz; Case Code (Metric): 1005; DatasheetVersion: 06/2012; Pins: 2; Min Operating Temperature: -55 degC; Case Code (Imperial): 0402; REACH SVHC: Unknown; Tolerance: 1%; Mounting Technology: Surface Mount; ComponentLink1URL: http://www.vishay.com/; ComponentLink2URL: http://www.vishay.com/docs/20035/dcrcwe3.pdf; ComponentLink2Description: Datasheet; Resistance: 8.06 KOhm; Max Operating Temperature: 155 degC; ComponentLink1Description: Manufacturer URL; Width: 0.5 mm; RoHSCompliant: true; PackageDescription: 2-Pin Surface Mount Device, Body 1 x 0.5 mm
R70 R77 = CMP-2002-05853-1: Manufacturer: Panasonic; Part Number: ERA-2AED331X
R73 = CMP-2002-05217-1: Manufacturer: Bourns; Part Number: CR0402-FX-4701GLF
R76 = CMP-2001-04478-1: Manufacturer: Yageo; Part Number: AC0805FR-070RL
U7 = CMP-04918-000654-1: Adjustable-Frequency Dual Step-Down Converter, 2.7-6V VIN, 0.6-5.5V 2A VOUT, VQFN-HR14
U8 = CMP-0244-00287-1: 1 A Low Quiescent Current Low Noise Voltage Regulator, Adjustable from 0.8V, 6-Pin VFDFPN, Tape and Reel; ComponentLink1URL: http://www.st.com; ComponentLink1Description: Manufacturer URL; ComponentLink2Description: Datasheet; DatasheetVersion: 1/10/2011; PackageDescription: 6-Pin Plastic, Dual LLP, 3 x 3 mm Body, 0.95 mm Pitch, Exposed Pad; PackageReference: DFN6D; ComponentLink2URL: http://www.st.com/internet/com/TECHNICAL_RESOURCES/TECHNICAL_LITERATURE/DATASHEET/CD00233788.pdf; PackageVersion: 2008
U9 = CMP-0859-00286-3: Automotive Catalog Low-Power Single 2-Input Positive-AND Gate, DCK0005A, LARGE T&R; Manufacturer: Texas Instruments; Generic Part Number: SN74AUP1G08-Q1; VCC(Min)(V): 0.8; Voltage(Nom)(V): 0.8,1.2,1.5,1.8,2.5,3.3; Input Type: CMOS; F @ Nom Voltage(Max)(Mhz): 100; tpd @ Nom Voltage(Max)(ns): 32.8,20.9,14.2,11,7.6,6.2; Gate Type: AND; Technology Family: AUP; VCC(Max)(V): 3.6; ICC @ Nom Voltage(Max)(mA): 0.0009; Output Drive (IOL/IOH)(Max)(mA): 20/-20; Schmitt Trigger: No; Bits(#): 1; Logic: True; Sub-Family: AND Gate; DatasheetVersion: SCES847; Rating: Automotive; Output Type: CMOS; Operating Temperature Range(C): -40 to 125; PackageReference: DCK0005A; 3-State Output: No

## Sheet 10-RJ45_Protection.SchDoc
size B; SheetNumber: 10; SheetTotal: 13
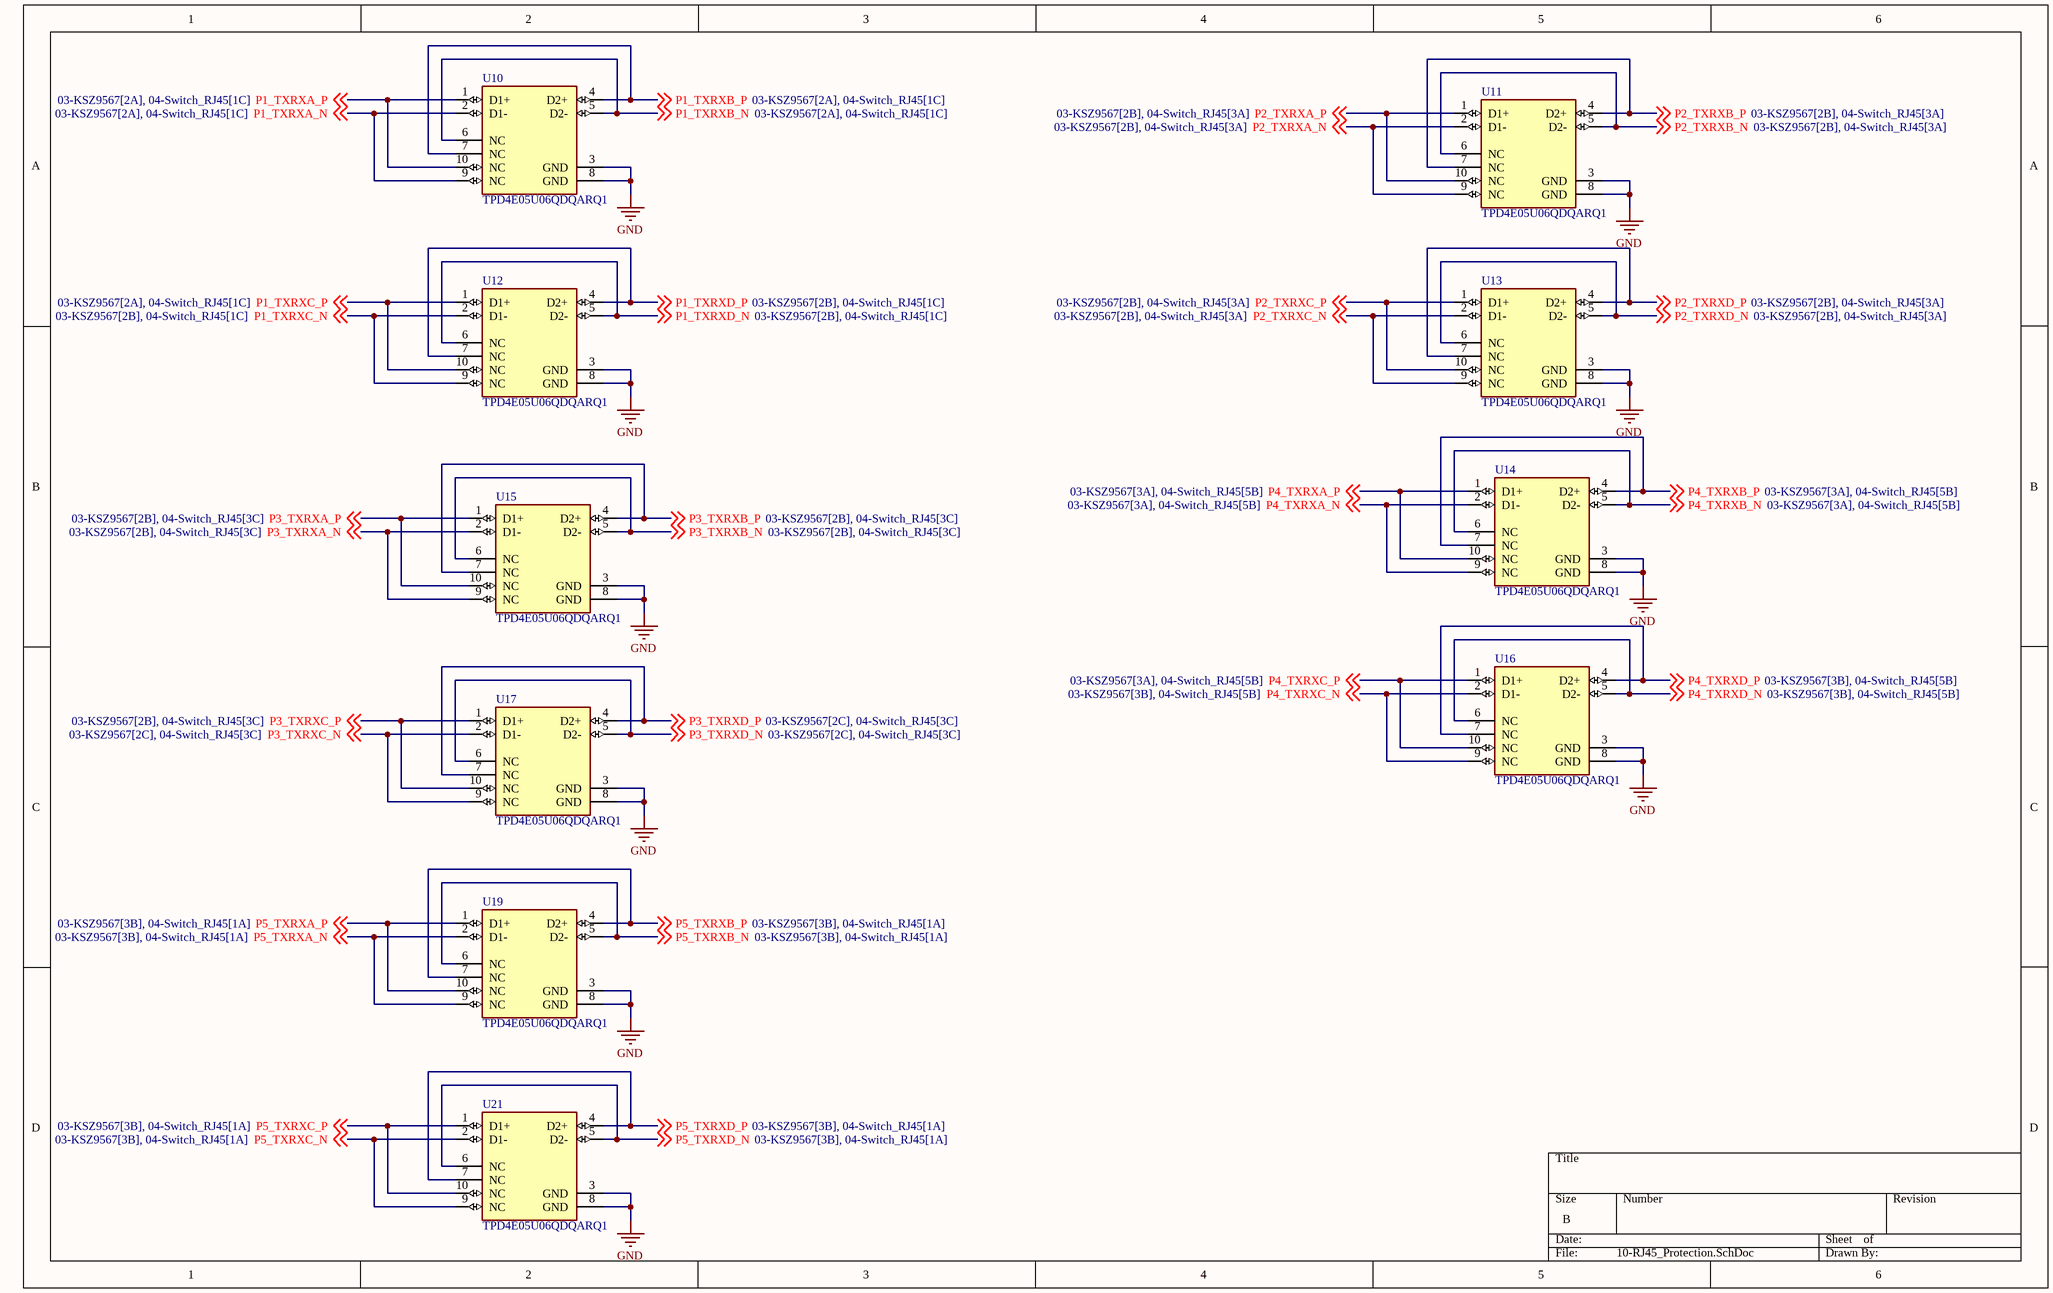
[diagram p7: 10-RJ45_Protection.SchDoc]

### Parts
U10  TPD4E05U06QDQARQ1  [FP-DQA0010A-MFG]
U11  TPD4E05U06QDQARQ1  [FP-DQA0010A-MFG]
U12  TPD4E05U06QDQARQ1  [FP-DQA0010A-MFG]
U13  TPD4E05U06QDQARQ1  [FP-DQA0010A-MFG]
U14  TPD4E05U06QDQARQ1  [FP-DQA0010A-MFG]
U15  TPD4E05U06QDQARQ1  [FP-DQA0010A-MFG]
U16  TPD4E05U06QDQARQ1  [FP-DQA0010A-MFG]
U17  TPD4E05U06QDQARQ1  [FP-DQA0010A-MFG]
U19  TPD4E05U06QDQARQ1  [FP-DQA0010A-MFG]
U21  TPD4E05U06QDQARQ1  [FP-DQA0010A-MFG]

### Nets
GND: U10.3(GND) U10.8(GND) U11.3(GND) U11.8(GND) U12.3(GND) U12.8(GND) U13.3(GND) U13.8(GND) U14.3(GND) U14.8(GND) U15.3(GND) U15.8(GND) U16.3(GND) U16.8(GND) U17.3(GND) U17.8(GND) U19.3(GND) U19.8(GND) U21.3(GND) U21.8(GND)
P1_TXRXA_N: U10.2(D1-) U10.9(NC) ; off-sheet P1_TXRXA_N
P1_TXRXA_P: U10.1(D1+) U10.10(NC) ; off-sheet P1_TXRXA_P
P1_TXRXB_N: U10.5(D2-) U10.6(NC) ; off-sheet P1_TXRXB_N
P1_TXRXB_P: U10.4(D2+) U10.7(NC) ; off-sheet P1_TXRXB_P
P1_TXRXC_N: U12.2(D1-) U12.9(NC) ; off-sheet P1_TXRXC_N
P1_TXRXC_P: U12.1(D1+) U12.10(NC) ; off-sheet P1_TXRXC_P
P1_TXRXD_N: U12.5(D2-) U12.6(NC) ; off-sheet P1_TXRXD_N
P1_TXRXD_P: U12.4(D2+) U12.7(NC) ; off-sheet P1_TXRXD_P
P2_TXRXA_N: U11.2(D1-) U11.9(NC) ; off-sheet P2_TXRXA_N
P2_TXRXA_P: U11.1(D1+) U11.10(NC) ; off-sheet P2_TXRXA_P
P2_TXRXB_N: U11.5(D2-) U11.6(NC) ; off-sheet P2_TXRXB_N
P2_TXRXB_P: U11.4(D2+) U11.7(NC) ; off-sheet P2_TXRXB_P
P2_TXRXC_N: U13.2(D1-) U13.9(NC) ; off-sheet P2_TXRXC_N
P2_TXRXC_P: U13.1(D1+) U13.10(NC) ; off-sheet P2_TXRXC_P
P2_TXRXD_N: U13.5(D2-) U13.6(NC) ; off-sheet P2_TXRXD_N
P2_TXRXD_P: U13.4(D2+) U13.7(NC) ; off-sheet P2_TXRXD_P
P3_TXRXA_N: U15.2(D1-) U15.9(NC) ; off-sheet P3_TXRXA_N
P3_TXRXA_P: U15.1(D1+) U15.10(NC) ; off-sheet P3_TXRXA_P
P3_TXRXB_N: U15.5(D2-) U15.6(NC) ; off-sheet P3_TXRXB_N
P3_TXRXB_P: U15.4(D2+) U15.7(NC) ; off-sheet P3_TXRXB_P
P3_TXRXC_N: U17.2(D1-) U17.9(NC) ; off-sheet P3_TXRXC_N
P3_TXRXC_P: U17.1(D1+) U17.10(NC) ; off-sheet P3_TXRXC_P
P3_TXRXD_N: U17.5(D2-) U17.6(NC) ; off-sheet P3_TXRXD_N
P3_TXRXD_P: U17.4(D2+) U17.7(NC) ; off-sheet P3_TXRXD_P
P4_TXRXA_N: U14.2(D1-) U14.9(NC) ; off-sheet P4_TXRXA_N
P4_TXRXA_P: U14.1(D1+) U14.10(NC) ; off-sheet P4_TXRXA_P
P4_TXRXB_N: U14.5(D2-) U14.6(NC) ; off-sheet P4_TXRXB_N
P4_TXRXB_P: U14.4(D2+) U14.7(NC) ; off-sheet P4_TXRXB_P
P4_TXRXC_N: U16.2(D1-) U16.9(NC) ; off-sheet P4_TXRXC_N
P4_TXRXC_P: U16.1(D1+) U16.10(NC) ; off-sheet P4_TXRXC_P
P4_TXRXD_N: U16.5(D2-) U16.6(NC) ; off-sheet P4_TXRXD_N
P4_TXRXD_P: U16.4(D2+) U16.7(NC) ; off-sheet P4_TXRXD_P
P5_TXRXA_N: U19.2(D1-) U19.9(NC) ; off-sheet P5_TXRXA_N
P5_TXRXA_P: U19.1(D1+) U19.10(NC) ; off-sheet P5_TXRXA_P
P5_TXRXB_N: U19.5(D2-) U19.6(NC) ; off-sheet P5_TXRXB_N
P5_TXRXB_P: U19.4(D2+) U19.7(NC) ; off-sheet P5_TXRXB_P
P5_TXRXC_N: U21.2(D1-) U21.9(NC) ; off-sheet P5_TXRXC_N
P5_TXRXC_P: U21.1(D1+) U21.10(NC) ; off-sheet P5_TXRXC_P
P5_TXRXD_N: U21.5(D2-) U21.6(NC) ; off-sheet P5_TXRXD_N
P5_TXRXD_P: U21.4(D2+) U21.7(NC) ; off-sheet P5_TXRXD_P

### Library data of the parts
U10-U17 U19 U21 = CMP-04985-000004-1: as U2 on sheet 07-KSZ9031_1G_BASET_XCVR; Operating Supply Voltage: 5.5V; Reverse Standoff Voltage: 5.5V; Package: DQA0010A; Temperature Range Low: -40°C; Temperature Range High: +125°C; Ambient Temperature Range Low: -40°C; Device Class L1: Circuit Protection; Clamping Voltage: 14V; Manufacturer Part Number: TPD4E05U06QDQARQ1; Device Class L2: ESD and Circuit Protection ICs; Octopart: https://octopart.com/tpd4e05u06qdqarq1-texas+instruments-48523459; Device Class L3: unset; Height: 0.55mm; Automotive: Yes; ComponentLink2Description: Datasheet; RoHS: TRUE; Ambient Temperature Range High: +125°C; Category: IC; Mouser Description: Automotive 4-Channel ESD Protection Solution for SuperSpeed (up to 5 Gbps) Interface 10-USON -40 to 125; Temperature: -40°C to +125°C; ComponentLink2URL: http://www.ti.com/lit/ds/symlink/tpd4e05u06-q1.pdf; Digikey Description: TVS DIODE 5.5V 14V 10USON; Lead Free: Yes

## Sheet 12-I225_1.SchDoc
size C; SheetNumber: 12; SheetTotal: 13
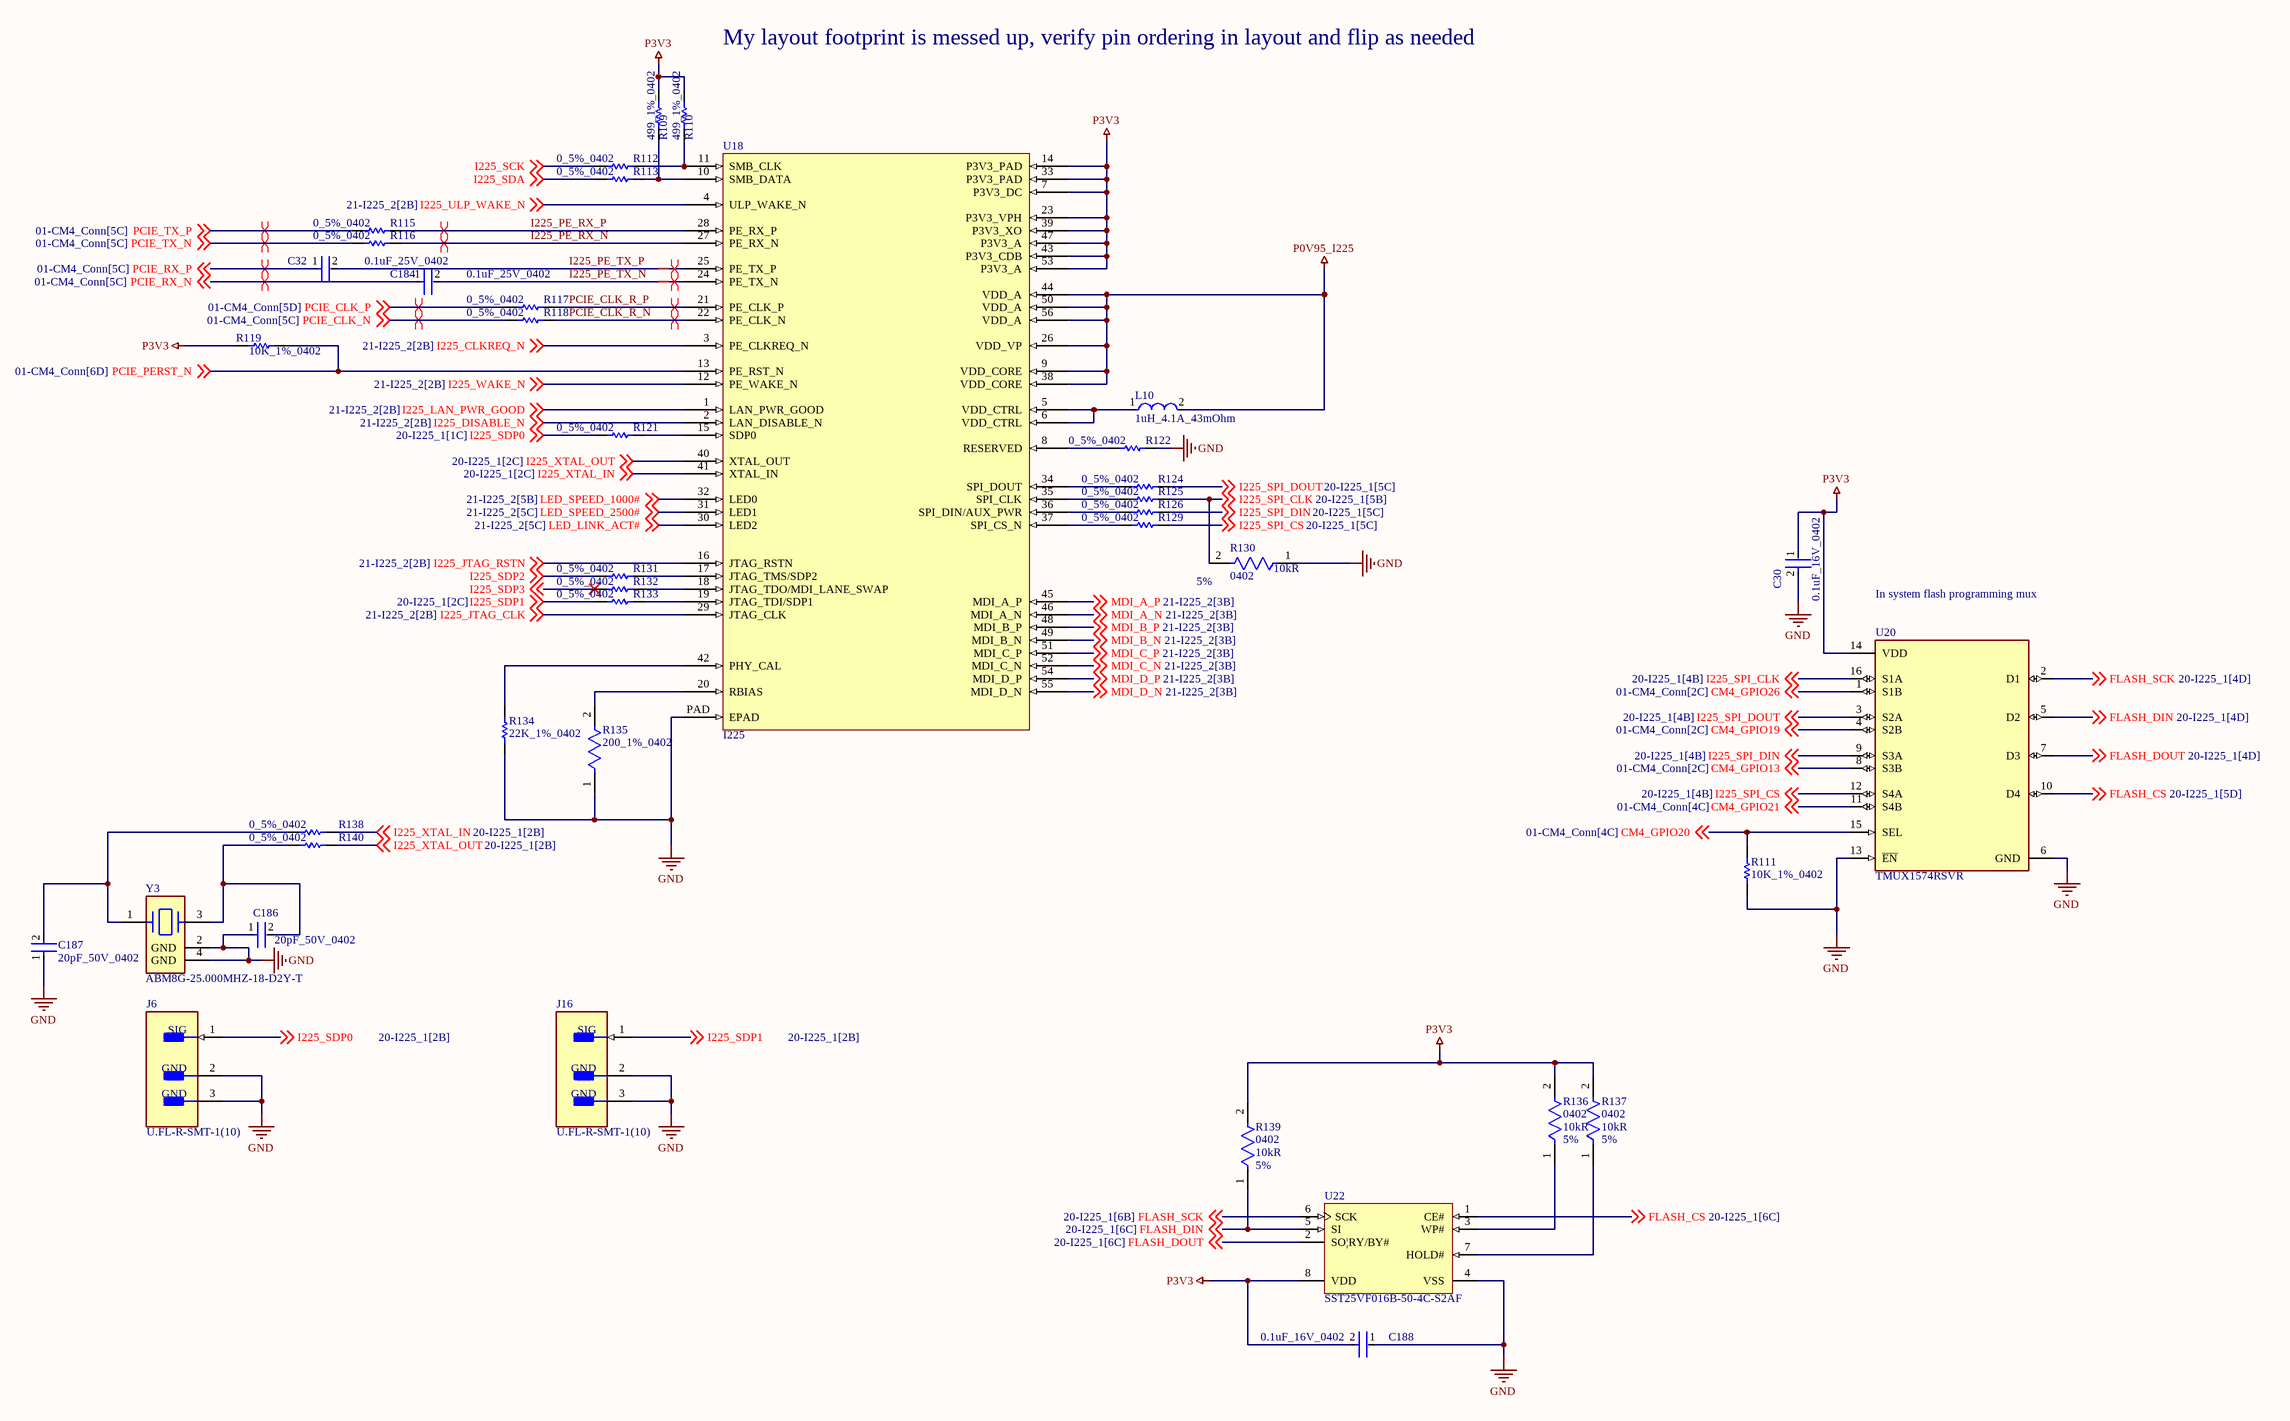
[diagram p8: 12-I225_1.SchDoc]

### Parts
C30  0.1uF_16V_0402  [FP-GRM15-MFG]
C32  0.1uF_25V_0402  [FP-0402-L_1_0_1-W_0_5_0_1-IPC_C]
C184  0.1uF_25V_0402  [FP-0402-L_1_0_1-W_0_5_0_1-IPC_C]
C186  20pF_50V_0402  [FP-C0402-BB-MFG]
C187  20pF_50V_0402  [FP-C0402-BB-MFG]
C188  0.1uF_16V_0402  [FP-GRM15-MFG]
J6  U.FL-R-SMT-1(10)  [FP-U_FL-R-SMT-1_10-MFG]
J16  U.FL-R-SMT-1(10)  [FP-U_FL-R-SMT-1_10-MFG]
L10  1uH_4.1A_43mOhm  [FP-CIGT201610-MFG]
R109  499_1%_0402  [RESC1005X40X25LL05T05]
R110  499_1%_0402  [RESC1005X40X25LL05T05]
R111  10K_1%_0402  [RESC1005X40X25NL10T10]
R112  0_5%_0402  [RESC1005X40X25LL10T10]
R113  0_5%_0402  [RESC1005X40X25LL10T10]
R115  0_5%_0402  [RESC1005X40X25LL10T10]
R116  0_5%_0402  [RESC1005X40X25LL10T10]
R117  0_5%_0402  [RESC1005X40X25LL10T10]
R118  0_5%_0402  [RESC1005X40X25LL10T10]
R119  10K_1%_0402  [RESC1005X40X25NL10T10]
R121  0_5%_0402  [RESC1005X40X25LL10T10]
R122  0_5%_0402  [RESC1005X40X25LL10T10]
R124  0_5%_0402  [RESC1005X40X25LL10T10]
R125  0_5%_0402  [RESC1005X40X25LL10T10]
R126  0_5%_0402  [RESC1005X40X25LL10T10]
R129  0_5%_0402  [RESC1005X40X25LL10T10]
R130  Case/Package: 0402  Resistance: 10kR  Tolerance: 5%  [FP-CRCW0402-e3-IPC_B]  (hidden comment: CRCW040210K0JNED)
R131  0_5%_0402  [RESC1005X40X25LL10T10]
R132  0_5%_0402  [RESC1005X40X25LL10T10]
R133  0_5%_0402  [RESC1005X40X25LL10T10]
R134  22K_1%_0402  [RESC1005X40X25NL05T05]
R135  200_1%_0402  [FP-CRCW0402-e3-IPC_C]
R136  Case/Package: 0402  Resistance: 10kR  Tolerance: 5%  [FP-CRCW0402-e3-IPC_B]  (hidden comment: CRCW040210K0JNED)
R137  Case/Package: 0402  Resistance: 10kR  Tolerance: 5%  [FP-CRCW0402-e3-IPC_B]  (hidden comment: CRCW040210K0JNED)
R138  0_5%_0402  [RESC1005X40X25LL10T10]
R139  Case/Package: 0402  Resistance: 10kR  Tolerance: 5%  [FP-CRCW0402-e3-IPC_B]  (hidden comment: CRCW040210K0JNED)
R140  0_5%_0402  [RESC1005X40X25LL10T10]
U18  I225  [I225 QFN56]
U20  TMUX1574RSVR  [FP-RSV0016A-MFG]
U22  SST25VF016B-50-4C-S2AF  [MCHP-SOIC-S2A8_M]
Y3  ABM8G-25.000MHZ-18-D2Y-T  [FP-ABM8G-MFG]

### Nets
GND: C30.2 C186.1 C187.1 C188.1 J6.2(GND) J6.3(GND) J16.2(GND) J16.3(GND) R111.2 R122.2 R130.1 R134.1 R135.1 U18.PAD(EPAD) U20.6(GND) U20.13(~{EN}) U22.4(VSS) Y3.2(GND) Y3.4(GND)
P0V95_I225: L10.2 U18.9(VDD_CORE) U18.26(VDD_VP) U18.38(VDD_CORE) U18.44(VDD_A) U18.50(VDD_A) U18.56(VDD_A)
P3V3: C30.1 C188.2 R109.2 R110.2 R119.2 R136.2 R137.2 R139.2 U18.7(P3V3_DC) U18.14(P3V3_PAD) U18.23(P3V3_VPH) U18.33(P3V3_PAD) U18.39(P3V3_XO) U18.43(P3V3_CDB) U18.47(P3V3_A) U18.53(P3V3_A) U20.14(VDD) U22.8(VDD)
CM4_GPIO13: U20.8(S3B) ; off-sheet CM4_GPIO13
CM4_GPIO19: U20.4(S2B) ; off-sheet CM4_GPIO19
CM4_GPIO20: R111.1 U20.15(SEL) ; off-sheet CM4_GPIO20
CM4_GPIO21: U20.11(S4B) ; off-sheet CM4_GPIO21
CM4_GPIO26: U20.1(S1B) ; off-sheet CM4_GPIO26
FLASH_CS: U20.10(D4) U22.1(CE#) ; off-sheet FLASH_CS
FLASH_DIN: R139.1 U20.5(D2) U22.5(SI) ; off-sheet FLASH_DIN
FLASH_DOUT: U20.7(D3) U22.2(SO|RY/BY#) ; off-sheet FLASH_DOUT
FLASH_SCK: U20.2(D1) U22.6(SCK) ; off-sheet FLASH_SCK
I225_CLKREQ_N: U18.3(PE_CLKREQ_N) ; off-sheet I225_CLKREQ_N
I225_DISABLE_N: U18.2(LAN_DISABLE_N) ; off-sheet I225_DISABLE_N
I225_JTAG_CLK: U18.29(JTAG_CLK) ; off-sheet I225_JTAG_CLK
I225_JTAG_RSTN: U18.16(JTAG_RSTN) ; off-sheet I225_JTAG_RSTN
I225_LAN_PWR_GOOD: U18.1(LAN_PWR_GOOD) ; off-sheet I225_LAN_PWR_GOOD
I225_PE_RX_N: R116.2 U18.27(PE_RX_N)
I225_PE_RX_P: R115.2 U18.28(PE_RX_P)
I225_PE_TX_N: C184.2 U18.24(PE_TX_N)
I225_PE_TX_P: C32.2 U18.25(PE_TX_P)
I225_SCK: R112.1 ; off-sheet I225_SCK
I225_SDA: R113.1 ; off-sheet I225_SDA
I225_SDP0: J6.1(SIG) R121.1 ; off-sheet I225_SDP0
I225_SDP1: J16.1(SIG) R133.1 ; off-sheet I225_SDP1
I225_SDP2: R131.1 ; off-sheet I225_SDP2
I225_SDP3: R132.1 ; off-sheet I225_SDP3
I225_SPI_CLK: R125.2 R130.2 U20.16(S1A) ; off-sheet I225_SPI_CLK
I225_SPI_CS: R129.2 U20.12(S4A) ; off-sheet I225_SPI_CS
I225_SPI_DIN: R126.2 U20.9(S3A) ; off-sheet I225_SPI_DIN
I225_SPI_DOUT: R124.2 U20.3(S2A) ; off-sheet I225_SPI_DOUT
I225_ULP_WAKE_N: U18.4(ULP_WAKE_N) ; off-sheet I225_ULP_WAKE_N
I225_WAKE_N: U18.12(PE_WAKE_N) ; off-sheet I225_WAKE_N
I225_XTAL_IN: R138.2 U18.41(XTAL_IN) ; off-sheet I225_XTAL_IN
I225_XTAL_OUT: R140.2 U18.40(XTAL_OUT) ; off-sheet I225_XTAL_OUT
LED_LINK_ACT#: U18.30(LED2) ; off-sheet LED_LINK_ACT#
LED_SPEED_1000#: U18.32(LED0) ; off-sheet LED_SPEED_1000#
LED_SPEED_2500#: U18.31(LED1) ; off-sheet LED_SPEED_2500#
MDI_A_N: U18.46(MDI_A_N) ; off-sheet MDI_A_N
MDI_A_P: U18.45(MDI_A_P) ; off-sheet MDI_A_P
MDI_B_N: U18.49(MDI_B_N) ; off-sheet MDI_B_N
MDI_B_P: U18.48(MDI_B_P) ; off-sheet MDI_B_P
MDI_C_N: U18.52(MDI_C_N) ; off-sheet MDI_C_N
MDI_C_P: U18.51(MDI_C_P) ; off-sheet MDI_C_P
MDI_D_N: U18.55(MDI_D_N) ; off-sheet MDI_D_N
MDI_D_P: U18.54(MDI_D_P) ; off-sheet MDI_D_P
PCIE_CLK_N: R118.1 ; off-sheet PCIE_CLK_N
PCIE_CLK_P: R117.1 ; off-sheet PCIE_CLK_P
PCIE_CLK_R_N: R118.2 U18.22(PE_CLK_N)
PCIE_CLK_R_P: R117.2 U18.21(PE_CLK_P)
PCIE_PERST_N: R119.1 U18.13(PE_RST_N) ; off-sheet PCIE_PERST_N
PCIE_RX_N: C184.1 ; off-sheet PCIE_RX_N
PCIE_RX_P: C32.1 ; off-sheet PCIE_RX_P
PCIE_TX_N: R116.1 ; off-sheet PCIE_TX_N
PCIE_TX_P: R115.1 ; off-sheet PCIE_TX_P
NetC186_2: C186.2 R140.1 Y3.3
NetC187_2: C187.2 R138.1 Y3.1
NetL10_1: L10.1 U18.5(VDD_CTRL) U18.6(VDD_CTRL)
NetR109_1: R109.1 R113.2 U18.10(SMB_DATA)
NetR110_1: R110.1 R112.2 U18.11(SMB_CLK)
NetR121_2: R121.2 U18.15(SDP0)
NetR122_1: R122.1 U18.8(RESERVED)
NetR124_1: R124.1 U18.34(SPI_DOUT)
NetR125_1: R125.1 U18.35(SPI_CLK)
NetR126_1: R126.1 U18.36(SPI_DIN/AUX_PWR)
NetR129_1: R129.1 U18.37(SPI_CS_N)
NetR131_2: R131.2 U18.17(JTAG_TMS/SDP2)
NetR132_2: R132.2 U18.18(JTAG_TDO/MDI_LANE_SWAP)
NetR133_2: R133.2 U18.19(JTAG_TDI/SDP1)
NetR134_2: R134.2 U18.42(PHY_CAL)
NetR135_2: R135.2 U18.20(RBIAS)
NetR136_1: R136.1 U22.3(WP#)
NetR137_1: R137.1 U22.7(HOLD#)

### Layout directives
differential pair: I225_PE_RX_N, I225_PE_RX_P, I225_PE_TX_N, I225_PE_TX_P, PCIE_CLK_N, PCIE_CLK_P, PCIE_CLK_R_N, PCIE_CLK_R_P, PCIE_RX_N, PCIE_RX_P, PCIE_TX_N, PCIE_TX_P

### Notes on the sheet
- My layout footprint is messed up, verify pin ordering in layout and flip as needed
- In system flash programming mux

### Library data of the parts
C30 C188 = CMP-2100-03641-2: CAP CER 0.1UF 16V X7R 0402; Manufacturer Part Number: GRM155R71C104KA88D; Manufacturer: Murata; Standoff Height: 0mm; Tolerance: 10%; Voltage Rating: 16Vdc; Material: Ceramic; Capacitance: 0.10μF; Value: 0.10μF; RoHS: TRUE; Temperature Characteristic: X7R; Octopart: https://octopart.com/grm155r71c104ka88d-murata-196880; Digikey Description: CAP CER 0.1UF 16V X7R 0402; Device Class L3: Ceramic Capacitors; Height: 0.55mm; ComponentLink2Description: Datasheet; Temperature Range Low: -55°C; Ipc Land Pattern Name: CAPC10050X219; ComponentLink2URL: https://search.murata.co.jp/Ceramy/image/img/A01X/G101/ENG/GRM155R71H471KA01-01A.pdf; Device Class L1: Passive Components; Lead Free: yes; Category: Cap; Package: GRM15; Temperature: -55°C to +125°C; Device Class L2: Capacitors; Temperature Range High: +125°C; Mouser Description: 0402 0.1 uF 16V ±10 % Tolerance X7R SMT Multilayer Ceramic Capacitor
C32 C184 = CMP-2008-02519-2: General Purpose Ceramic Capacitor, 0402, 100nF, 10%, X7R, 15%, 25V; Package Quantity: 1; Capacitance: 100nF; Min Operating Temperature: -55°C; Voltage: 25V; Voltage Rating: 25V; Construction: Flat; Max Operating Temperature: 125°C; Radiation Hardening: No; Depth: 0.5mm; Thickness: 0.022inch; Voltage Rating (DC): 25V; Number of Pins: 2; Lead Free: Lead Free; Series: -; REACH SVHC: No SVHC; Length: 1mm; Dielectric: X7R; RoHS Compliant: Yes; Mount: Surface Mount; Packaging: Tape and Reel; Case/Package: 0402; Case Code (Imperial): 0402; Termination: SMD/SMT; Width: 0.02inch; Case Code (Metric): 1005; Tolerance: 10%
C186 C187 = CMP-1034-00890-3: CAP CER 20PF 50V 5% NP0 0402; Manufacturer Part Number: C0402C200J5GACTU; Manufacturer: Kemet; Tolerance: 0.05; Material: Ceramic; Temperature Characteristic: C0G; Temperature Coefficient: 15%; Octopart: https://octopart.com/c0402c200j5gactu-kemet-9143900; ComponentLink2Description: Datasheet; RoHS: TRUE; Ipc Land Pattern Name: CAPC10050X50; Temperature: -55°C to +125°C; Lead Free: Yes; Mouser Description: Multilayer Ceramic Capacitors MLCC - SMD/SMT 50volts 20pF C0G 5%; Device Class L1: Passive Components; Category: Cap; Package: C0402-BB; Temperature Range High: +125°C; Voltage Rating: 50 V; Temperature Range Low: -55°C; Device Class L2: Capacitors; Device Class L3: Ceramic Capacitors; Height: 0.55mm; Capacitance: 20 pF; Value: 20 pF; ComponentLink2URL: https://content.kemet.com/datasheets/KEM_C1002_X7R_SMD.pdf; Digikey Description: CAP CER 20PF 50V 5% NP0 0402; Automotive: No
J6 J16 = CMP-2000-05152-3: CONN U.FL RCPT STR 50 OHM SMD; Max Frequency: 6GHz; Connector Type: Coaxial; Body Plating: Silver; Body Material: Bronze; Impedance: 50R; Dielectric Material: Polymer; Insulation Resistance: 500MR; Gender: Male; Packaging: Cut Tape; Length: 3mm; Package Quantity: 2500; Termination: Solder; Lead Free: Lead Free; Series: U.FL; Min Operating Temperature: -40°C; Fastening Type: Snap; Contact Material: Brass; Orientation: Straight; Wire/Cable Type: Coaxial; Frequency: 6GHz; Contact Plating: Gold; Depth: 3.1mm; Weight: 0.001764oz; Max Operating Temperature: 90°C; Radiation Hardening: No; REACH SVHC: No SVHC; Mount: Surface Mount; Housing Color: Beige
L10 = CMP-13278-000005-1: FIXED IND 1UH 4.1A 43 MOHM SMD; DC Resistance (DCR): 43mR; Shielding: Unshielded; Saturation Current: 4.5A; Tolerance: 20%; Core Material: Metal; Test Frequency: 1MHz; Resistor Type: Thin Film; Case Code (Imperial): 0806; Case Code (Metric): 2016; RoHS Compliant: Yes; Min Operating Temperature: -40°C; Mount: Surface Mount; Max Operating Temperature: 125°C; Packaging: Cut Tape; Current Rating: 4.1A; Case/Package: 0806; Inductance: 1uH
R109 R110 = CMP-2002-00965-1: Manufacturer: Panasonic; Part Number: ERJ-2RKF4990X
R111 R119 = CMP-2002-04694-1: Manufacturer: Bourns; Part Number: CR0402-FX-1002GLF
R112 R113 R115-R118 R121 R122 R124-R126 R129 R131-R133 R138 R140 = CMP-2002-04569-1: Manufacturer: KOA Speer; Part Number: RK73Z1ETTP
R130 R136 R137 R139 = CMP-2002-08136-3: RES Thick Film, 10kΩ, 5%, 0.063W, 200ppm/°C, 0402; Voltage Rating: 50V; Power Rating: 63mW; Military Standard: Not; Packaging: Tape and Reel; Case Code (Imperial): 0402; Min Operating Temperature: -55°C; Case Code (Metric): 1005; Temperature Coefficient: 200ppm/°C; Termination: SMD/SMT; Composition: Thick Film; Depth: 0.5mm; Number of Terminations: 2; Contact Plating: Tin; Height: 0.016inch; Width: 0.5mm; Max Operating Temperature: 155°C; Features: Automotive AEC-Q200; Length: 1mm; Radiation Hardening: No; Max Power Dissipation: 63mW; Mount: Surface Mount; Package Quantity: 1; Weight: 2.3E-05oz
R134 = CMP-1011-00659-2: Part Number: CRCW040222K0FKED; Manufacturer: Vishay Dale
R135 = CMP-1011-00429-3: RES Thick Film, 200Ω, 1%, 0.063W, 100ppm/°C, 0402; Max Power Dissipation: 63mW; Voltage Rating: 50V; Resistance: 200R; Termination: SMD/SMT; Weight: 2.3E-05oz; Case/Package: 0402; Contact Plating: Tin; Number of Pins: 2; Width: 0.5mm; Height: 0.35mm; Case Code (Metric): 1005; Military Standard: Not; Features: Automotive AEC-Q200; Power Rating: 63mW; Temperature Coefficient: 100ppm/°C; Tolerance: 1%; Lead Free: Lead Free; Depth: 0.5mm; Max Operating Temperature: 155°C; Min Operating Temperature: -55°C; Package Quantity: 10; Voltage Rating (DC): 50V; Composition: Thick Film; Mount: Surface Mount; Radiation Hardening: No; Length: 1mm; Packaging: Tape and Reel; Number of Terminations: 2; Case Code (Imperial): 0402
U20 = CMP-04892-000064-2: IC SWITCH SPDT QUAD 16UQFN; RoHS Compliant: Yes
U22 = CMP-0378-00041-1: 16 Mbit SPI Serial Flash, 2.7 to 3.6 V, 50 MHz, 0 to 70 degC, 8-pin SOIC (S2A8), Tube; Manufacturer: Microchip; PackageReference: SOIC-S2A8; PackageVersion: Rev. A; ComponentLink3URL: http://ww1.microchip.com/downloads/en/DeviceDoc/25051A.pdf; ComponentLink1Description: Manufacturer URL; ComponentLink4URL: http://www.microchip.com/SST25VF016B; ComponentLink1URL: http://www.microchip.com; DatasheetVersion: Rev. A; ComponentLink2URL: http://ww1.microchip.com/downloads/en/DeviceDoc/25044A.pdf; PackageDescription: 8-Lead Plastic Small Outline Intergrated Circuit, 5.275 x 5.275 mm Body, 1.27 mm Pitch; PartNumber: SST25VF016B-50-4C-S2AF; ComponentLink3Description: Package Specification; ComponentLink2Description: Datasheet; Mounting Technology: Surface Mount; ComponentLink4Description: Product URL
Y3 = CMP-2000-05733-2: CRYSTAL 25.0000MHZ 18PF SMD; Manufacturer: Abracon; Stability: 30ppm; Frequency: 25MHz; Esr: 60Ω; Tolerance: 20ppm; Automotive: No; Series: ABM8G; Temperature Range High: +85°C; ComponentLink2URL: https://abracon.com/Resonators/ABM8G.pdf; RoHS: TRUE; Octopart: https://octopart.com/abm8g-25.000mhz-18-d2y-t-abracon-12676602; Package: ABM8G; Category: Crys; Device Class L2: Crystals / Oscillators; ComponentLink2Description: Datasheet; Manufacturer Part Number: ABM8G-25.000MHZ-18-D2Y-T; Height: 1mm; Lead Free: Yes; Digikey Description: CRYSTAL 25.0000MHZ 18PF SMD; Temperature Range Low: -40°C; Device Class L3: Crystals; Load Capacitance: 18pF; Temperature: -40°C to +85°C; Device Class L1: Passive Components; Mouser Description: Crystals 25.000MHz 18pF 30ppm -40C +85C